# EAGLE design Longboard (EAGLE 8.0.0)

## Sheet 1 of 2
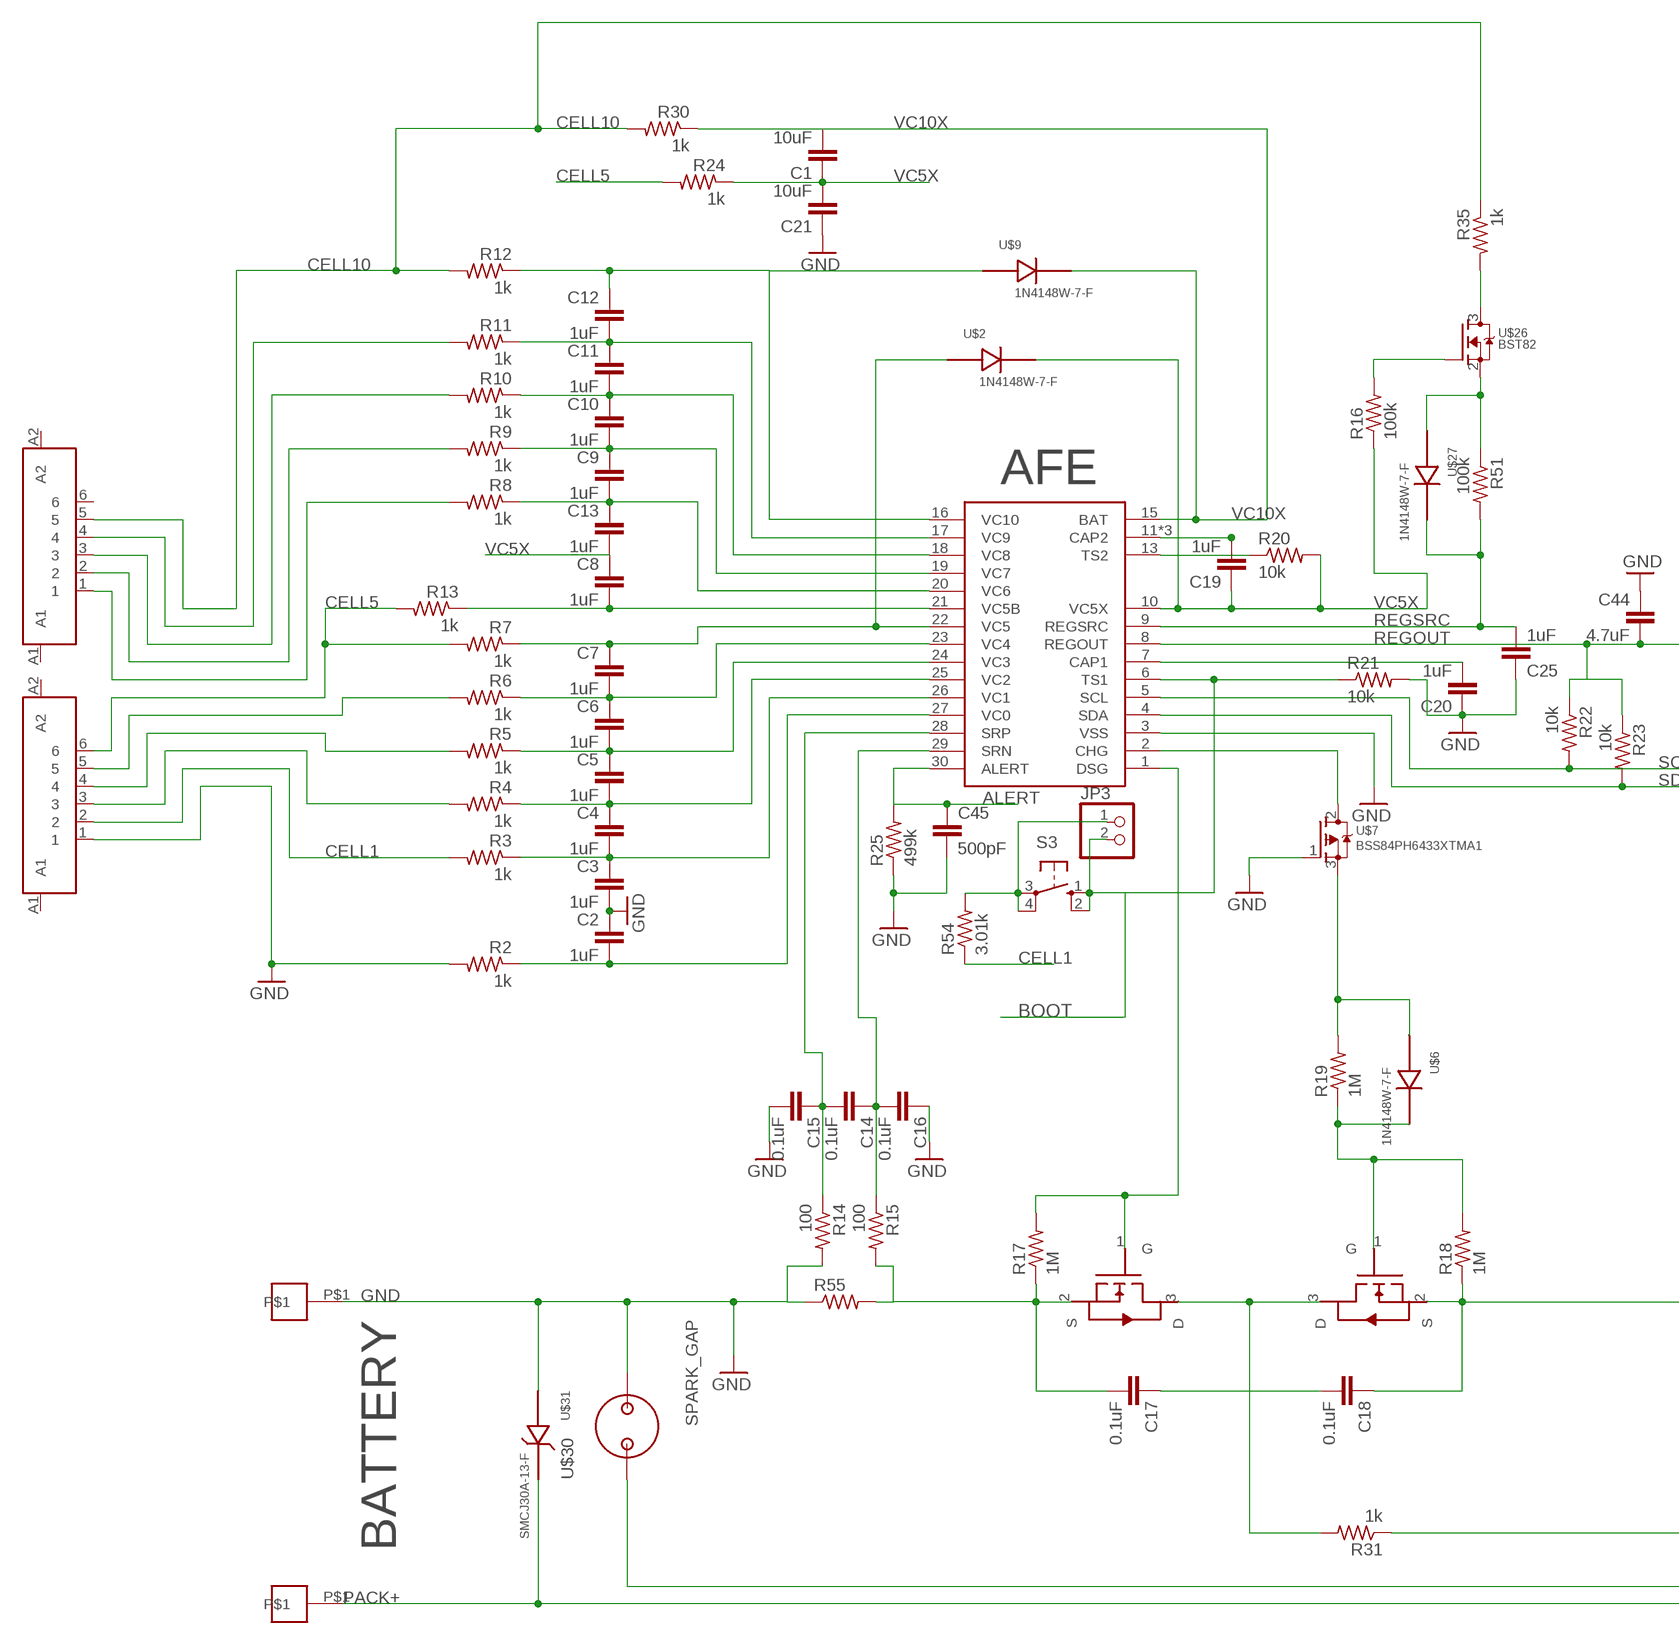
[diagram p0: schematic, sheet 1, part 1 of 2]
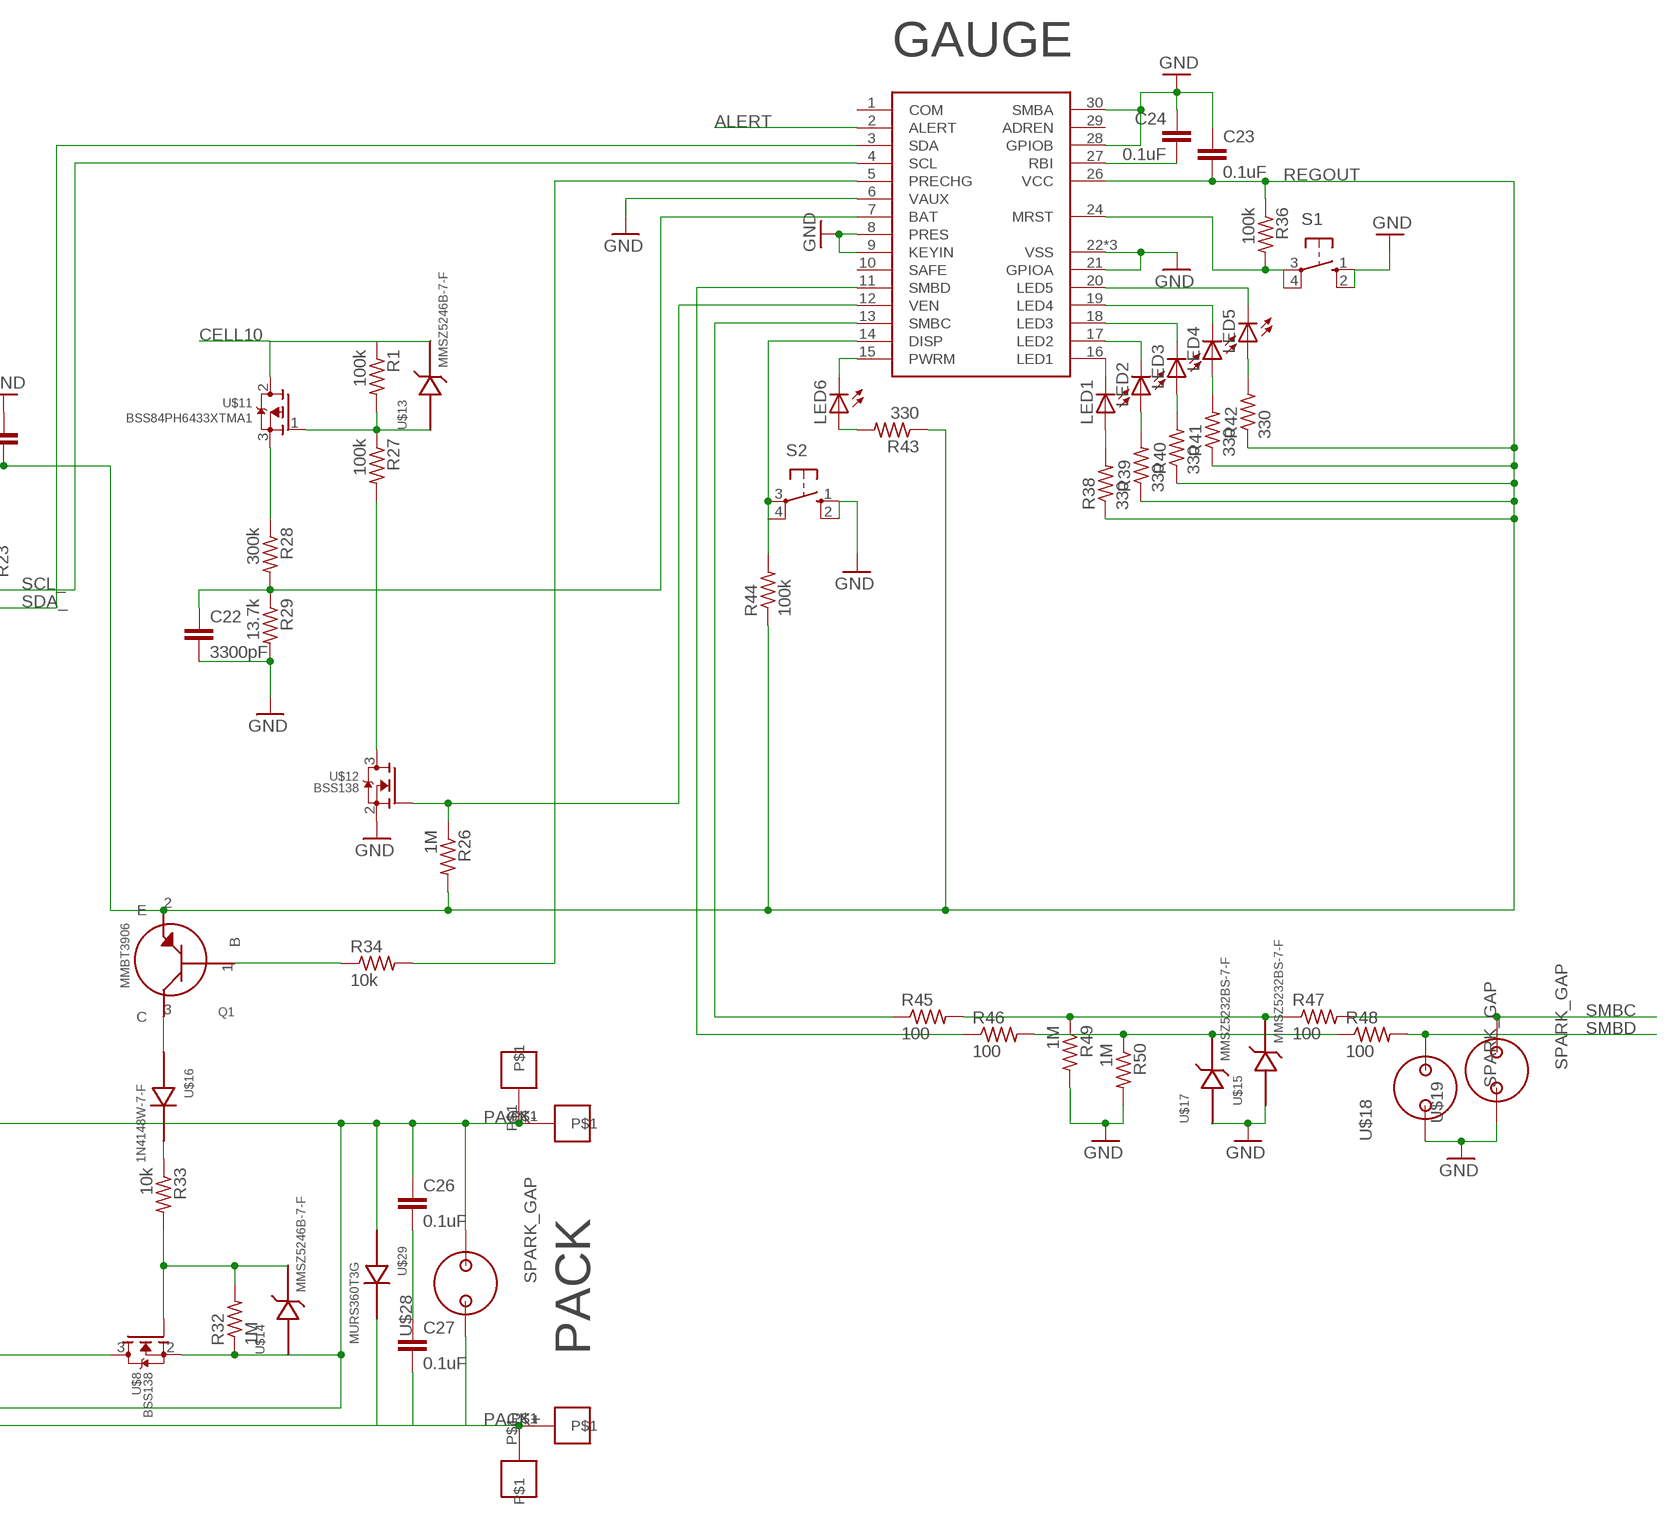
[diagram p1: schematic, sheet 1, part 2 of 2]

### Parts
C1  10uF  C-EUC1210  [C1210]
C2  1uF  C-EUC0805  [C0805]
C3  1uF  C-EUC0805  [C0805]
C4  1uF  C-EUC0805  [C0805]
C5  1uF  C-EUC0805  [C0805]
C6  1uF  C-EUC0805  [C0805]
C7  1uF  C-EUC0805  [C0805]
C8  1uF  C-EUC0805  [C0805]
C9  1uF  C-EUC0805  [C0805]
C10  1uF  C-EUC0805  [C0805]
C11  1uF  C-EUC0805  [C0805]
C12  1uF  C-EUC0805  [C0805]
C13  1uF  C-EUC0805  [C0805]
C14  0.1uF  C-EUC0805  [C0805]
C15  0.1uF  C-EUC0805  [C0805]
C16  0.1uF  C-EUC0805  [C0805]
C17  0.1uF  C-EUC0805  [C0805]
C18  0.1uF  C-EUC0805  [C0805]
C19  1uF  C-EUC0805  [C0805]
C20  1uF  C-EUC0805  [C0805]
C21  10uF  C-EUC1210  [C1210]
C22  3300pF  C-EUC0402  [C0402]
C23  0.1uF  C-EUC0805  [C0805]
C24  0.1uF  C-EUC0805  [C0805]
C25  1uF  C-EUC0805  [C0805]
C26  0.1uF  C-EUC0805  [C0805]
C27  0.1uF  C-EUC0805  [C0805]
C44  4.7uF  C-EUC0805  [C0805]
C45  500pF  C-EUC0603  [C0603]
JP3  PINHD-1X2  [1X02]
LED1  LEDCHIPLED_0603  [CHIPLED_0603]
LED2  LEDCHIPLED_0603  [CHIPLED_0603]
LED3  LEDCHIPLED_0603  [CHIPLED_0603]
LED4  LEDCHIPLED_0603  [CHIPLED_0603]
LED5  LEDCHIPLED_0603  [CHIPLED_0603]
LED6  LEDCHIPLED_0603  [CHIPLED_0603]
Q1  MMBT3906  [SOT23-3]
R1  100k  R-US_R0805  [R0805]
R2  1k  R-US_R1206  [R1206]
R3  1k  R-US_R1206  [R1206]
R4  1k  R-US_R1206  [R1206]
R5  1k  R-US_R1206  [R1206]
R6  1k  R-US_R1206  [R1206]
R7  1k  R-US_R1206  [R1206]
R8  1k  R-US_R1206  [R1206]
R9  1k  R-US_R1206  [R1206]
R10  1k  R-US_R1206  [R1206]
R11  1k  R-US_R1206  [R1206]
R12  1k  R-US_R1206  [R1206]
R13  1k  R-US_R1206  [R1206]
R14  100  R-US_R0805  [R0805]
R15  100  R-US_R0805  [R0805]
R16  100k  R-US_R0805  [R0805]
R17  1M  R-US_R1206  [R1206]
R18  1M  R-US_R1206  [R1206]
R19  1M  R-US_R1206  [R1206]
R20  10k  R-US_R0805  [R0805]
R21  10k  R-US_R0805  [R0805]
R22  10k  R-US_R0805  [R0805]
R23  10k  R-US_R0805  [R0805]
R24  1k  R-US_R1206  [R1206]
R25  499k  R-US_R0603  [R0603]
R26  1M  R-US_R1206  [R1206]
R27  100k  R-US_R0805  [R0805]
R28  300k  R-US_R0805  [R0805]
R29  13.7k  R-US_R0805  [R0805]
R30  1k  R-US_R1206  [R1206]
R31  1k  R-US_R2512  [R2512]
R32  1M  R-US_R1206  [R1206]
R33  10k  R-US_R0805  [R0805]
R34  10k  R-US_R0805  [R0805]
R35  1k  R-US_R1206  [R1206]
R36  100k  R-US_R0805  [R0805]
R38  330  R-US_R0402  [R0402]
R39  330  R-US_R0402  [R0402]
R40  330  R-US_R0402  [R0402]
R41  330  R-US_R0402  [R0402]
R42  330  R-US_R0402  [R0402]
R43  330  R-US_R0402  [R0402]
R44  100k  R-US_R0402  [R0402]
R45  100  R-US_R0805  [R0805]
R46  100  R-US_R0805  [R0805]
R47  100  R-US_R0805  [R0805]
R48  100  R-US_R0805  [R0805]
R49  1M  R-US_R1206  [R1206]
R50  1M  R-US_R1206  [R1206]
R51  100k  R-US_R0805  [R0805]
R54  3.01k  R-US_R1206  [R1206]
R55  R-US_R2512  [R2512]
S1  10-XX  [B3F-10XX]
S2  10-XX  [B3F-10XX]
S3  10-XX  [B3F-10XX]
U$1  BQ76930  [SOIC-30]
U$2  1N4148W-7-F  [SOD-123]
U$3  PAD  [PAD]
U$4  AOB290L  [TO-263]
U$5  AOB290L  [TO-263]
U$6  1N4148W-7-F  [SOD-123]
U$7  BSS84PH6433XTMA1  [SOT23-3]
U$8  BSS138  [SOT23-3]
U$9  1N4148W-7-F  [SOD-123]
U$10  BQ78350-R1  [SOIC-30]
U$11  BSS84PH6433XTMA1  [SOT23-3]
U$12  BSS138  [SOT23-3]
U$13  MMSZ5246B-7-F  [SOD-123]
U$14  MMSZ5246B-7-F  [SOD-123]
U$15  MMSZ5232BS-7-F  [SOD-323F]
U$16  1N4148W-7-F  [SOD-123]
U$17  MMSZ5232BS-7-F  [SOD-323F]
U$18  SPARK_GAP  [SPARK_GAP]
U$19  SPARK_GAP  [SPARK_GAP]
U$24  JST_6PIN  [JST_6PIN]
U$26  BST82  [SOT23-3]
U$27  1N4148W-7-F  [SOD-123]
U$28  SPARK_GAP  [SPARK_GAP]
U$29  MURS360T3G  [SMC(DO-214AB)]
U$30  SPARK_GAP  [SPARK_GAP]
U$31  SMCJ30A-13-F  [SMB(DO-214AA)]
U$33  JST_6PIN  [JST_6PIN]
U$35  PAD  [PAD]
U$36  PAD  [PAD]
U$37  PAD  [PAD]
U$38  PAD  [PAD]
U$39  PAD  [PAD]

### Nets
ALERT: C45.1 R25.2 U$1.30(ALERT) U$10.2(ALERT)
BOOT: JP3.2 R21.1 S3.1(S) S3.2(S1) U$1.6(TS1)
CELL1: R3.2 R54.1 U$33.2
CELL5: R7.2 R13.2 R24.2 U$33.6
CELL10: R1.1 R12.2 R30.2 R35.1 U$11.2(S) U$13.P$2 U$24.5
GND: C2.1 C3.2 C15.2 C16.1 C20.1 C21.1 C22.2 C23.1 C24.1 C25.1 C44.1 C45.2 R2.2 R14.2 R21.2 R25.1 R29.2 R49.2 R50.2 R55.1 S1.1(S) S1.2(S1) S2.1(S) S2.2(S1) U$1.3(VSS) U$3.P$1 U$7.1(G) U$10.6(VAUX) U$10.8(PRES) U$10.9(KEYIN) U$10.21(GPIOA) U$10.22(VSS) U$10.23(VSS) U$10.25(VSS) U$10.28(GPIOB) U$10.30(SMBA) U$12.2(S) U$15.1 U$17.1 U$18.P$1 U$19.P$1 U$30.P$2 U$31.P$1 U$33.1 ; also sheet 2
N$1: C3.1 C4.2 R3.1 U$1.26(VC1)
N$2: C4.1 C5.2 R4.1 U$1.25(VC2)
N$3: C5.1 C6.2 R5.1 U$1.24(VC3)
N$4: C6.1 C7.2 R6.1 U$1.23(VC4)
N$5: C7.1 R7.1 U$1.22(VC5) U$2.P$1
N$6: C8.2 R13.1 U$1.21(VC5B)
N$7: C9.1 C10.2 R9.1 U$1.19(VC7)
N$8: C10.1 C11.2 R10.1 U$1.18(VC8)
N$9: C11.1 C12.2 R11.1 U$1.17(VC9)
N$10: C12.1 R12.1 U$1.16(VC10) U$9.P$1
N$11: R5.2 U$33.4
N$12: C2.2 R2.1 U$1.27(VC0)
N$14: C26.2 C27.1
N$15: R4.2 U$33.3
N$16: R6.2 U$33.5
N$18: R8.2 U$24.1
N$19: R9.2 U$24.2
N$20: R10.2 U$24.3
N$21: R11.2 U$24.4
N$22: R31.1 U$8.3(D)
N$23: C9.2 C13.1 R8.1 U$1.20(VC6)
N$24: R16.2 U$26.1(G)
N$25: C20.2 U$1.7(CAP1)
N$26: C14.1 C16.2 R15.1 U$1.29(SRN)
N$27: JP3.1 R54.2 S3.3(P) S3.4(P1)
N$28: C14.2 C15.1 R14.1 U$1.28(SRP)
N$29: C17.2 R15.2 R17.1 R55.2 U$4.2(S)
N$31: R31.2 U$4.3(D) U$5.3(D)
N$32: R18.2 R19.1 U$5.1(G) U$6.P$2
N$33: R19.2 U$6.P$1 U$7.3(D)
N$34: U$1.2(CHG) U$7.2(S)
N$35: C17.1 C18.2
N$37: C19.2 U$1.11(CAP2) U$1.12(CAP2) U$1.14(CAP2)
N$38: R20.1 U$1.13(TS2)
N$40: R26.1 U$10.12(VEN) U$12.1(G)
N$41: R27.2 U$12.3(D)
N$43: R1.2 R27.1 U$11.1(G) U$13.P$1
N$44: R28.1 U$11.3(D)
N$45: C22.1 R28.2 R29.1 U$10.7(BAT)
N$46: R32.2 R33.2 U$8.1(G) U$14.P$2
N$47: Q1.3(C) U$16.P$1
N$48: R33.1 U$16.P$2
N$49: Q1.1(B) R34.1
N$50: C24.2 U$10.27(RBI)
N$51: R36.2 S1.3(P) S1.4(P1) U$10.24(MRST)
N$52: LED1.A R38.2
N$53: LED2.A R39.2
N$54: LED3.A R40.2
N$55: LED4.A R41.2
N$56: LED5.A R42.2
N$57: LED1.C U$10.16(LED1)
N$58: LED2.C U$10.17(LED2)
N$59: LED3.C U$10.18(LED3)
N$60: LED4.C U$10.19(LED4)
N$61: LED5.C U$10.20(LED5)
N$62: LED6.A R43.2
N$63: R44.2 S2.3(P) S2.4(P1) U$10.14(DISP)
N$64: LED6.C U$10.15(PWRM)
N$65: R34.2 U$10.5(PRECHG)
N$66: R46.1 U$10.11(SMBD)
N$67: R45.1 U$10.13(SMBC)
N$68: R45.2 R47.1 R49.1 U$15.2
N$69: R46.2 R48.1 R50.1 U$17.2
N$70: R51.1 U$26.2(S) U$27.P$1
N$72: R35.2 U$26.3(D)
N$73: R17.2 U$1.1(DSG) U$4.1(G)
PACK+: C27.2 U$28.P$1 U$29.2 U$31.P$2 U$35.P$1 U$36.P$1 U$39.P$1
PACK-: C18.1 C26.1 R18.1 R32.1 U$5.2(S) U$8.2(S) U$14.P$1 U$28.P$2 U$29.1 U$30.P$1 U$37.P$1 U$38.P$1
REGOUT: C23.2 C44.2 Q1.2(E) R22.1 R23.1 R26.2 R36.1 R38.1 R39.1 R40.1 R41.1 R42.1 R43.1 R44.1 U$1.8(REGOUT) U$10.26(VCC) ; also sheet 2
REGSRC: C25.2 R51.2 U$1.9(REGSRC) U$27.P$2
SCL_: R22.2 U$1.5(SCL) U$10.4(SCL)
SDA_: R23.2 U$1.4(SDA) U$10.3(SDA)
SMBC: R47.2 U$19.P$2 ; also sheet 2
SMBD: R48.2 U$18.P$2 ; also sheet 2
VC5X: C1.1 C8.1 C13.2 C19.1 C21.2 R16.1 R20.2 R24.1 U$1.10(VC5X) U$2.P$2
VC10X: C1.2 R30.1 U$1.15(BAT) U$9.P$2
Unconnected: U$10.1(COM) U$10.10(SAFE) U$10.29(ADREN) U$24.6 U$24.A1 U$24.A2 U$33.A1 U$33.A2

### Notes on the sheet
- GAUGE
- AFE
- PACK
- BATTERY

## Sheet 2 of 2
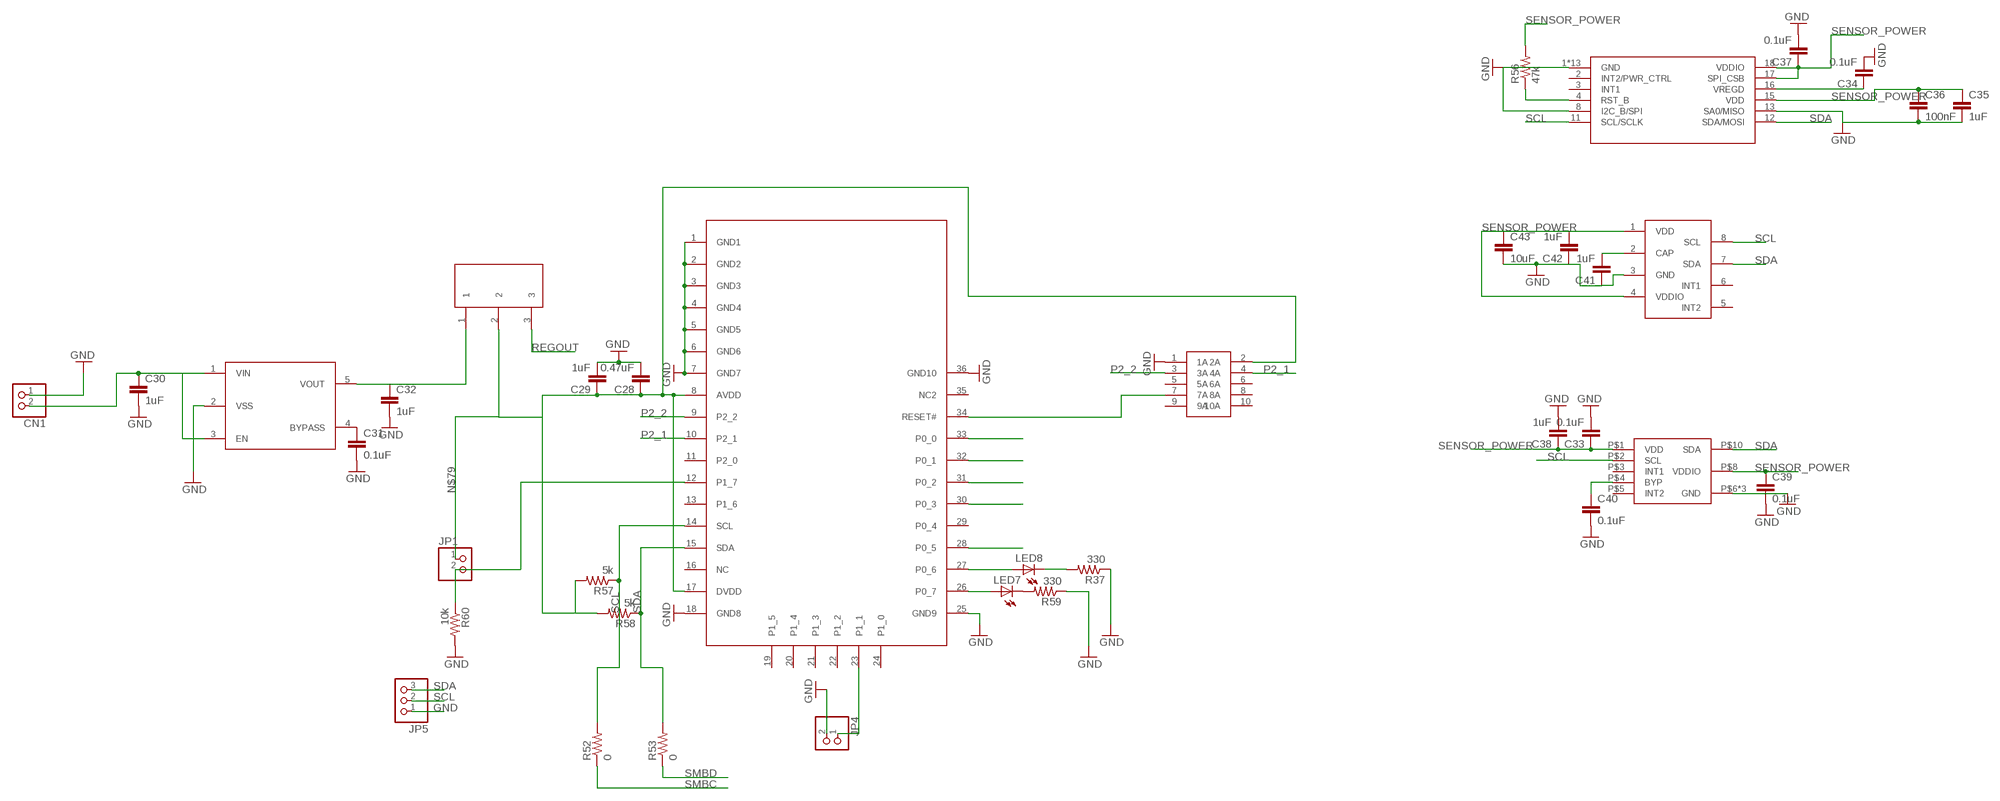
[diagram p2: schematic, sheet 2]

### Parts
C28  0.47uF  C-EUC0402  [C0402]
C29  1uF  C-EUC0402  [C0402]
C30  1uF  C-EUC0402  [C0402]
C31  0.1uF  C-EUC0402  [C0402]
C32  1uF  C-EUC0402  [C0402]
C33  0.1uF  C-EUC0402  [C0402]
C34  0.1uF  C-EUC0402  [C0402]
C35  1uF  C-EUC0402  [C0402]
C36  100nF  C-EUC0402  [C0402]
C37  0.1uF  C-EUC0402  [C0402]
C38  1uF  C-EUC0402  [C0402]
C39  0.1uF  C-EUC0402  [C0402]
C40  0.1uF  C-EUC0402  [C0402]
C41  1uF  C-EUC0402  [C0402]
C42  1uF  C-EUC0402  [C0402]
C43  10uF  C-EUC0603  [C0603]
CN1  JST_2PIN-THM  [JST-PH-2-THM]
JP1  PINHD-1X2  [1X02]
JP4  PINHD-1X2  [1X02]
JP5  PINHD-1X3  [1X03]
LED7  LEDCHIP-LED0603  [CHIP-LED0603]
LED8  LEDCHIP-LED0603  [CHIP-LED0603]
R37  330  R-US_R0402  [R0402]
R52  0  R-US_R0201  [R0201]
R53  0  R-US_R0201  [R0201]
R56  47k  R-US_R0402  [R0402]
R57  5k  R-US_R0402  [R0402]
R58  5k  R-US_R0402  [R0402]
R59  330  R-US_R0402  [R0402]
R60  10k  R-US_R0402  [R0402]
U$20  BLE113  [BLUEGIGA]
U$21  LP3985  [SOT23-5L]
U$22  RIBBON_10POS_MALE  [RIBBON_10POS_MALE]
U$23  SPDT_THRU  [SPDT_THRU]
U$25  MLP3115A2  [MLP3115A2]
U$32  MMA8653FC  [10-DFN2X2]
U$34  FXAS21002  [FXAS21002]

### Nets
CARD2: U$20.32(P0_1)
CD: U$20.33(P0_0)
CLK: U$20.28(P0_5)
GND: C28.2 C29.2 C30.2 C31.2 C32.2 C33.2 C34.2 C35.2 C36.2 C37.2 C38.2 C39.2 C40.2 C41.1 C42.1 C43.2 CN1.1 JP4.2 JP5.1 R37.1 R59.1 R60.2 U$20.1(GND1) U$20.2(GND2) U$20.3(GND3) U$20.4(GND4) U$20.5(GND5) U$20.6(GND6) U$20.7(GND7) U$20.18(GND8) U$20.25(GND9) U$20.36(GND10) U$21.2(VSS) U$22.1(1A) U$25.3(GND) U$32.P$6(GND) U$32.P$7(GND) U$32.P$9(GND) U$34.1(GND) U$34.5(GND) U$34.6(GND) U$34.7(GND) U$34.8(I2C_B/SPI) U$34.9(GND) U$34.10(GND) U$34.13(SA0/MISO) U$34.14(GND) U$34.19(GND) U$34.20(GND) U$34.21(GND) U$34.22(GND) U$34.23(GND) U$34.24(GND) ; also sheet 1
MISO: U$20.31(P0_2)
MOSI: U$20.30(P0_3)
N$13: LED8.A U$20.27(P0_6)
N$17: LED8.C R37.2
N$30: R56.1 U$34.4(RST_B)
N$36: LED7.A U$20.26(P0_7)
N$39: C30.1 CN1.2 U$21.1(VIN) U$21.3(EN)
N$42: JP4.1 U$20.23(P1_1)
N$71: JP1.2 R60.1 U$20.12(P1_7)
N$74: C31.1 U$21.4(BYPASS)
N$75: C32.1 U$21.5(VOUT) U$23.1
N$76: LED7.C R59.2
N$77: U$20.34(RESET#) U$22.7(7A)
N$78: C34.1 U$34.16(VREGD)
N$79: C28.1 C29.1 JP1.1 R57.2 R58.2 U$20.8(AVDD) U$20.17(DVDD) U$22.2(2A) U$23.2
N$81: C41.2 U$25.2(CAP)
N$84: C40.1 U$32.P$4(BYP)
P2_1: U$20.10(P2_1) U$22.4(4A)
P2_2: U$20.9(P2_2) U$22.3(3A)
REGOUT: U$23.3 ; also sheet 1
SCL: JP5.2 R52.2 R57.1 U$20.14(SCL) U$25.8(SCL) U$32.P$2(SCL) U$34.11(SCL/SCLK)
SDA: JP5.3 R53.2 R58.1 U$20.15(SDA) U$25.7(SDA) U$32.P$10(SDA) U$34.12(SDA/MOSI)
SENSOR_POWER: C33.1 C35.1 C36.1 C37.1 C38.1 C39.1 C42.2 C43.1 R56.2 U$25.1(VDD) U$25.4(VDDIO) U$32.P$1(VDD) U$32.P$8(VDDIO) U$34.15(VDD) U$34.17(SPI_CSB) U$34.18(VDDIO)
SMBC: R52.1 ; also sheet 1
SMBD: R53.1 ; also sheet 1
Unconnected: U$20.11(P2_0) U$20.13(P1_6) U$20.16(NC) U$20.19(P1_5) U$20.20(P1_4) U$20.21(P1_3) U$20.22(P1_2) U$20.24(P1_0) U$20.29(P0_4) U$20.35(NC2) U$22.5(5A) U$22.6(6A) U$22.8(8A) U$22.9(9A) U$22.10(10A) U$25.5(INT2) U$25.6(INT1) U$32.P$3(INT1) U$32.P$5(INT2) U$34.2(INT2/PWR_CTRL) U$34.3(INT1)

## Library data of the parts
C1-C45 = rcl:C-EU: CAPACITOR, European symbol
CN1 = adafruit:JST_2PIN: JST 2-Pin Connectors of various flavors SMT-RA (S2B-PH-SM4) 4UConnector #17311 SMT (B2B-PH-SM4) THM-RA (S2B-PH) THM (B2B-PH)
JP1 JP3 JP4 = pinhead:PINHD-1X2: PIN HEADER
JP5 = pinhead:PINHD-1X3: PIN HEADER
LED1-LED8 = adafruit:LED: LED OSRAM: - CHIPLED LG R971, LG N971, LY N971, LG Q971, LY Q971, LO R971, LY R971 LH N974, LH R974 LS Q976, LO Q976, LY Q976 LO Q996 - Hyper CHIPLED LW Q18S LB Q993, LB Q99A, LB R99A - SideLED LS A670, LO A670, LY A670, LG A670, LP A670 LB A673, LV A673, LT A673, LW A673 LH A674 LY A675 LS A676, LA A676, LO A676, LY A676, LW A676 LS A679, LY A679, LG A679 - Hyper Micro SIDELED® LS Y876, LA Y876, LO Y876, LY Y876 LT Y87S - SmartLED LW L88C, LW L88S LB L89C, LB L89S, LG L890 LS L89K, LO L89K, LY L89K LS L896, LA L896, LO L896, LY L896 - TOPLED LS T670, LO T670, LY T670, LG T670, LP T670 LSG T670, LSP T670, LSY T670, LOP T670, LYG T670 LG T671, LOG T671, LSG T671 LB T673, LV T673, LT T673, LW T673 LH T674 LS T676, LA T676, LO T676, LY T676, LB T676, LH T676, LSB T676, LW T676 LB T67C, LV T67C, LT T67C, LS T67K, LO T67K, LY T67K, LW E67C LS E67B, LA E67B, LO E67B, LY E67B, LB E67C, LV E67C, LT E67C LW T67C LS T679, LY T679, LG T679 LS T770, LO T770, LY T770, LG T770, LP T770 LB T773, LV T773, LT T773, LW T773 LH T774 LS E675, LA E675, LY E675, LS T675 LS T776, LA T776, LO T776, LY T776, LB T776 LHGB T686 LT T68C, LB T68C - Hyper Mini TOPLED® LB M676 - Mini TOPLED Santana® LG M470 LS M47K, LO M47K, LY M47K Source: http://www.osram.convergy.de/
Q1 = Charles:MMBT3906: TRANSISTOR PNP 40V 0.2A
R1-R60 = rcl:R-US_: RESISTOR, American symbol
S1-S3 = switch-omron:10-XX: OMRON SWITCH; MPN: B3F-1000; OC_FARNELL: 176432; OC_NEWARK: 36M3542
U$1 = Charles:BQ76930
U$2 U$6 U$9 U$16 U$27 = Charles:1N4148W-7-F: DIODE GENERAL PURPOSE 100V 300MA
U$3 U$35-U$39 = Charles:PAD
U$4 U$5 = Charles:AOB290L
U$7 U$11 = Charles:BSS84PH6433XTMA1: MOSFET P-Channel 60V 170MA SOT-23
U$8 U$12 = Charles:BSS138: MOSFET N-CH 50V 220MA
U$10 = Charles:BQ78350-R1
U$13 U$14 = Charles:MMSZ5246B-7-F: ZENER DIODE 16V 500MW
U$15 U$17 = Charles:MMSZ5232BS-7-F: ZENER DIODE 5.6V 200MW
U$18 U$19 U$28 U$30 = Charles:SPARK_GAP: Spark Gap 0.2mm ~2kV for ESD Protection
U$20 = James_Updated:BLE113
U$21 = James_Updated:LP3985
U$22 = James_Updated:RIBBON_10POS_MALE
U$23 = James_Updated:SPDT_THRU
U$24 U$33 = James_Updated:JST_6PIN
U$25 = Charles:MLP3115A2: I2C Precision Altimeter
U$26 = Charles:BST82: MOSFET N-CH 50V 220MA
U$29 = Charles:MURS360T3G: Ultrafast Power Rectifier, Diode General Purpose 600V 3A
U$31 = Charles:SMCJ30A-13-F: Zener Diode - 600 Watt Transient Voltage Suppressor - 30VWM 48.4VC - Diode Inc.
U$32 = Charles:MMA8653FC: 3-Axis, 10-bit Digital Accelerometer
U$34 = Charles:FXAS21002: 3-Axis Digital Angular Rate Gyroscope (I2C/SPI)

## Board
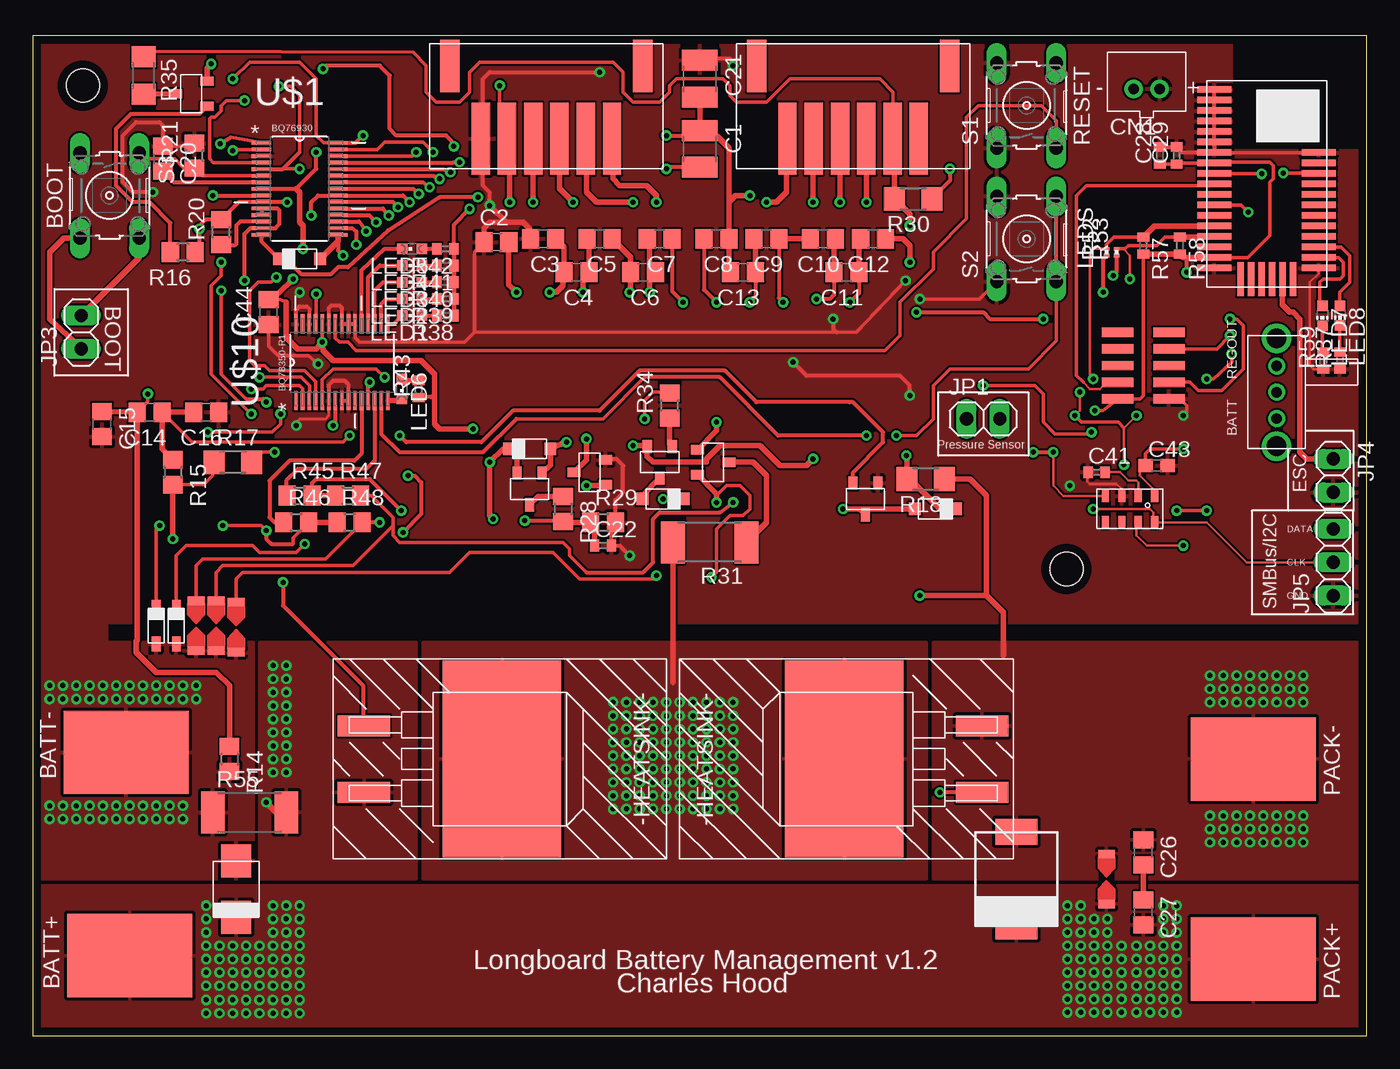
[diagram p3: board, top side]
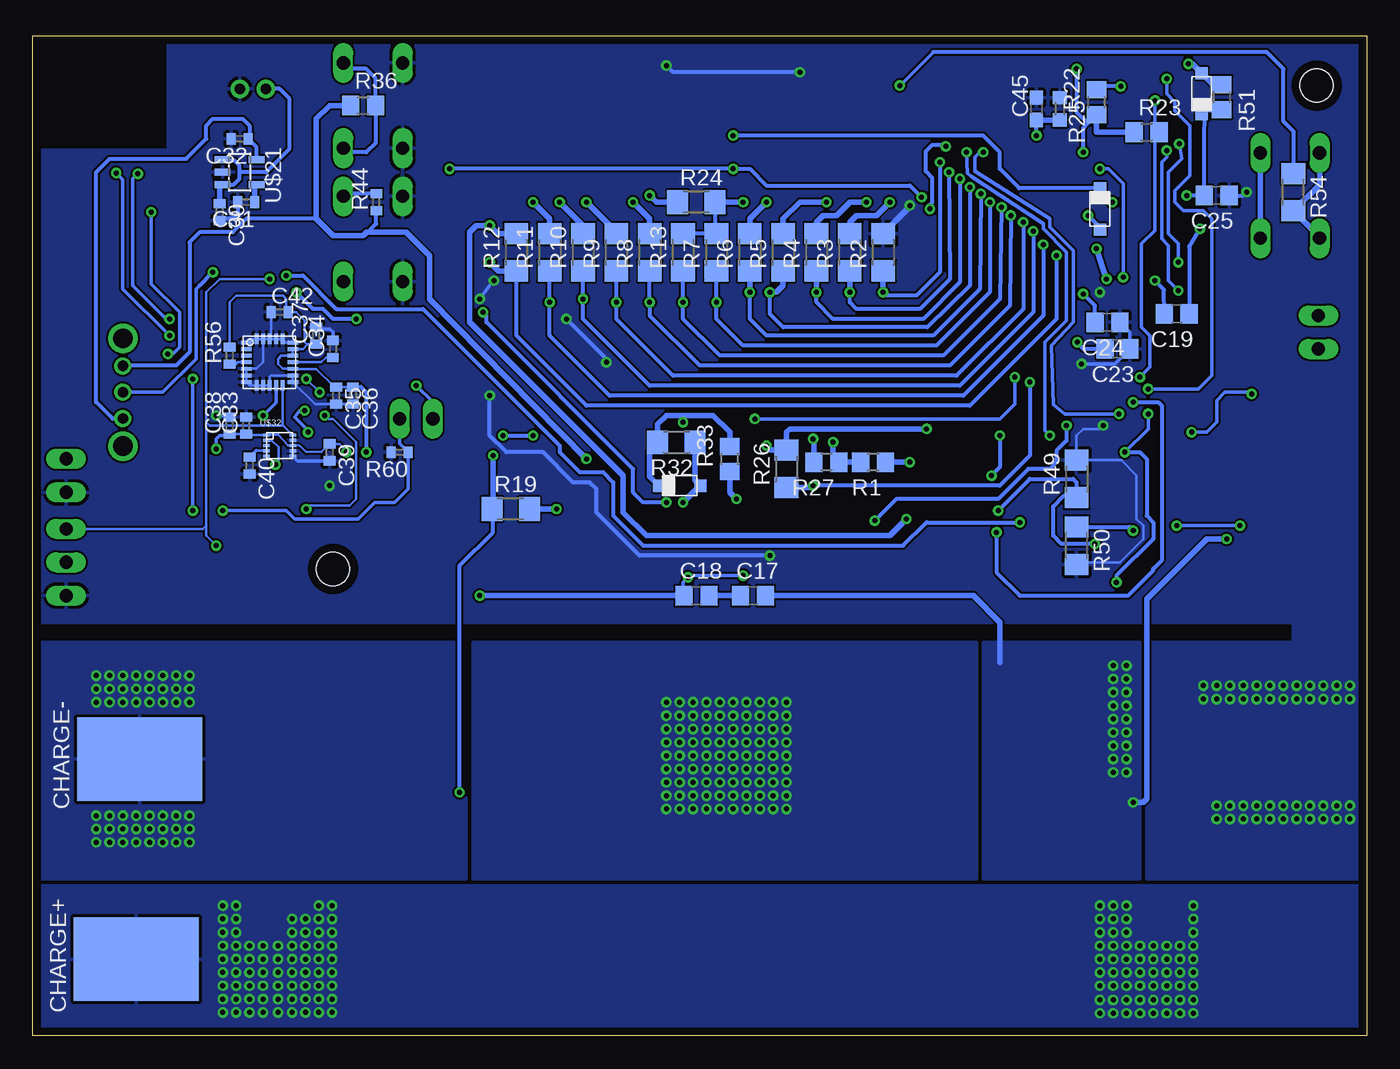
[diagram p4: board, bottom side, seen from below]

Size 101.6 x 76.2 mm. Coordinates in mm from the lower left corner, seen from the top.
Outline: 101.6,0 101.6,76.2 0,76.2 0,0 101.6,0
Copper layers (1*16): Top 0.035mm / dielectric 1.5mm / Bottom 0.035mm
Design rules "DRC_rules": minimum track width 8mil, minimum drill 15mil, track to track 6mil, track to pad 6mil, pad to pad 6mil, via to via 6mil, smd to smd 6mil, copper to edge 25mil, drill to drill 6mil, minimum pad ring 10mil, minimum via ring 8mil, stop-mask expansion 4mil, vias tented up to drill 0mil, thermal gap 10mil
Holes 2.54 mm at 3.81,72.39 78.74,35.56
tRestrict: area 91.4,67.6 to 103.6,76.2
bRestrict: area 91.4,67.6 to 103.6,76.2

### Footprints (pad centres in the part's own frame; a part is rotated, then mirrored left to right if it is on the bottom)
C1210 = smd 1.6 x 2.7: 1 -1.4,0; 2 1.4,0
C0805 = smd 1.3 x 1.5: 1 -0.95,0; 2 0.95,0
C0402 = smd 0.7 x 0.9: 1 -0.65,0; 2 0.65,0
C0603 = smd 1.1 x 1: 1 -0.85,0; 2 0.85,0
JST-PH-2-THM = drill 0.8 pad 1.422: 1 1,0; 2 -1,0
1X02 = drill 1.016 long: 1 -1.27,0; 2 1.27,0
1X03 = drill 1.016 long: 1 -2.54,0; 2 0,0; 3 2.54,0
CHIPLED_0603 = smd 0.8 x 0.8: A 0,-0.75; C 0,0.75
CHIP-LED0603 = smd 0.8 x 0.8: A 0,-0.75; C 0,0.75
SOT23-3 = smd 0.7 x 1: 1 -0.95,-1.2; 2 0.95,-1.2; 3 0,1.2
R0805 = smd 1.3 x 1.5: 1 -0.95,0; 2 0.95,0
R1206 = smd 1.6 x 1.803: 1 -1.422,0; 2 1.422,0
R0603 = smd 1 x 1.1: 1 -0.85,0; 2 0.85,0
R2512 = smd 1.8 x 3.2: 1 -2.8,0; 2 2.8,0
R0402 = smd 0.7 x 0.9: 1 -0.65,0; 2 0.65,0
R0201 = smd 0.28 x 0.43: 1 -0.255,0; 2 0.255,0
B3F-10XX = drill 1.016 long: 1 -3.251,2.261; 2 3.251,2.261; 3 -3.251,-2.261; 4 3.251,-2.261
SOIC-30 = smd 1.473 x 0.279: 1 -2.921,3.505; 2 -2.921,2.997; 3 -2.921,2.489; 4 -2.921,2.007; 5 -2.921,1.499; 6 -2.921,0.991; 7 -2.921,0.508; 8 -2.921,0; 9 -2.921,-0.508; 10 -2.921,-0.991; 11 -2.921,-1.499; 12 -2.921,-2.007; 13 -2.921,-2.489; 14 -2.921,-2.997; 15 -2.921,-3.505; 16 2.921,-3.505; 17 2.921,-2.997; 18 2.921,-2.489; 19 2.921,-2.007; 20 2.921,-1.499; 21 2.921,-0.991; 22 2.921,-0.508; 23 2.921,0; 24 2.921,0.508; 25 2.921,0.991; 26 2.921,1.499; 27 2.921,2.007; 28 2.921,2.489; 29 2.921,2.997; 30 2.921,3.505
SOD-123 = smd 0.9 x 0.95: P$1 -1.575,0; P$2 1.575,0
PAD = smd 9.525 x 6.35: P$1 0,0
TO-263 = smd 1.6 x 4: 1 -2.54,-5.25; 2 2.54,-5.25 | smd 15 x 9: 3 0,5.25
SOD-323F = smd 0.65 x 1.15: 1 0,1.4; 2 0,-1.4
SPARK_GAP = smd 1.27 x 0.635: P$1 0,1.905; P$2 0,-1.905
BLUEGIGA = smd 2.6 x 0.5: 1 -3.975,9.6; 2 -3.975,8.8; 3 -3.975,8; 4 -3.975,7.2; 5 -3.975,6.4; 6 -3.975,5.6; 7 -3.975,4.8; 8 -3.975,4; 9 -3.975,3.2; 10 -3.975,2.4; 11 -3.975,1.6; 12 -3.975,0.8; 13 -3.975,0; 14 -3.975,-0.8; 15 -3.975,-1.6; 16 -3.975,-2.4; 17 -3.975,-3.2; 18 -3.975,-4; 25 3.975,-4; 26 3.975,-3.2; 27 3.975,-2.4; 28 3.975,-1.6; 29 3.975,-0.8; 30 3.975,0; 31 3.975,0.8; 32 3.975,1.6; 33 3.975,2.4; 34 3.975,3.2; 35 3.975,4; 36 3.975,4.8 | smd 0.5 x 2.6: 19 -2,-4.85; 20 -1.2,-4.85; 21 -0.4,-4.85; 22 0.4,-4.85; 23 1.2,-4.85; 24 2,-4.85
SOT23-5L = smd 0.55 x 1.2: 1 -0.95,-1.3; 2 0,-1.3; 3 0.95,-1.3; 4 0.95,1.3; 5 -0.95,1.3
RIBBON_10POS_MALE = smd 0.72 x 2.4: 1 -5.08,-1.95; 2 -5.08,1.95; 3 -3.81,-1.95; 4 -3.81,1.95; 5 -2.54,-1.95; 6 -2.54,1.95; 7 -1.27,-1.95; 8 -1.27,1.95; 9 0,-1.95; 10 0,1.95
SPDT_THRU = drill 0.787: 1 -2.007,0; 2 0,0; 3 2.007,0 | drill 1.499: A1 -4.102,0; A2 4.102,0
JST_6PIN = smd 1.4 x 5.5: 1 -5,-2.775; 2 -3,-2.775; 3 -1,-2.775; 4 1,-2.775; 5 3,-2.775; 6 5,-2.775 | smd 1.5 x 4: A1 -7.35,2.775; A2 7.35,2.775
MLP3115A2 = smd 0.95 x 0.55: 1 -1,1.875; 2 -1,0.625; 3 -1,-0.625; 4 -1,-1.875; 5 1,-1.875; 6 1,-0.625; 7 1,0.625; 8 1,1.875
SMC(DO-214AB) = smd 1.96 x 3.2: 1 -3.6,0; 2 3.6,0
SMB(DO-214AA) = smd 2.5 x 2.3: P$1 -2.15,0; P$2 2.15,0
10-DFN2X2 = smd 0.5 x 0.24: P$1 -1,0.8; P$2 -1,0.4; P$3 -1,0; P$4 -1,-0.4; P$5 -1,-0.8; P$6 1,-0.8; P$7 1,-0.4; P$8 1,0; P$9 1,0.4; P$10 1,0.8
FXAS21002 = smd 0.8 x 0.3: 1 -1.775,1.5; 2 -1.775,1; 3 -1.775,0.5; 4 -1.775,0; 5 -1.775,-0.5; 6 -1.775,-1; 7 -1.775,-1.5; 13 1.775,-1.5; 14 1.775,-1; 15 1.775,-0.5; 16 1.775,0; 17 1.775,0.5; 18 1.775,1; 19 1.775,1.5 | smd 0.3 x 0.8: 8 -1,-1.775; 9 -0.5,-1.775; 10 0,-1.775; 11 0.5,-1.775; 12 1,-1.775; 20 1,1.775; 21 0.5,1.775; 22 0,1.775; 23 -0.5,1.775; 24 -1,1.775

### Placement (x,y rotation side)
C1  50.8,67.56 270 top
C2  35.31,60.45 0 top
C3  38.86,60.71 180 top
C4  41.4,58.17 180 top
C5  43.18,60.71 180 top
C6  46.48,58.17 180 top
C7  47.75,60.71 180 top
C8  52.07,60.71 180 top
C9  55.88,60.71 180 top
C10  60.2,60.71 180 top
C11  61.98,58.17 180 top
C12  64.01,60.71 180 top
C13  54.1,58.17 180 top
C14  8.89,47.5 180 top
C15  5.27,46.61 270 top
C16  13.21,47.5 180 top
C17  46.74,33.53 0 bottom
C18  51.05,33.53 0 bottom
C19  14.48,54.99 180 bottom
C20  9.91,66.8 270 top
C21  50.8,72.9 270 top
C22  43.43,37.34 0 top
C23  18.97,52.32 180 bottom
C24  19.74,54.36 180 bottom
C25  11.43,64.01 180 bottom
C26  84.58,13.97 270 top
C27  84.58,9.4 270 top
C28  85.85,67.06 90 top
C29  87.12,67.06 90 top
C30  87.38,62.74 270 bottom
C31  85.34,63.5 180 bottom
C32  85.85,68.33 180 bottom
C33  85.34,46.48 90 bottom
C34  78.74,52.32 90 bottom
C35  78.49,48.77 270 bottom
C36  77.22,48.77 270 bottom
C37  80.01,53.34 90 bottom
C38  86.61,46.48 90 bottom
C39  78.99,44.45 270 bottom
C40  85.09,43.43 270 bottom
C41  81.03,42.93 0 top
C42  82.8,55.12 0 bottom
C43  85.6,43.43 0 top
C44  17.96,55.12 90 top
C45  25.15,70.61 90 bottom
CN1  84.84,72.14 0 top
JP1  72.39,46.99 0 top
JP3  3.68,53.59 90 top
JP4  99.06,42.67 270 top
JP5  99.06,36.07 90 top
LED1  28.88,54.86 90 top
LED2  28.88,56.13 90 top
LED3  28.88,57.4 90 top
LED4  28.88,58.67 90 top
LED5  28.88,59.94 90 top
LED6  28.12,49.28 180 top
LED7  98.22,54.84 180 top
LED8  99.57,54.86 180 top
Q1  47.75,43.69 180 top
R1  37.59,43.69 180 bottom
R2  36.83,59.69 90 bottom
R3  39.37,59.69 90 bottom
R4  41.91,59.69 90 bottom
R5  44.45,59.69 90 bottom
R6  46.99,59.69 90 bottom
R7  49.53,59.69 90 bottom
R8  54.61,59.69 90 bottom
R9  57.15,59.69 90 bottom
R10  59.69,59.69 90 bottom
R11  62.23,59.69 90 bottom
R12  64.77,59.69 90 bottom
R13  52.07,59.69 90 bottom
R14  14.99,21.08 270 top
R15  10.67,42.93 270 top
R16  11.43,59.69 180 top
R17  15.24,43.69 0 top
R18  68,42.42 180 top
R19  65.2,40.13 0 bottom
R20  14.35,61.21 90 top
R21  12.32,67.06 90 top
R22  20.57,71.12 90 bottom
R23  16.76,68.83 0 bottom
R24  51.05,63.5 0 bottom
R25  23.37,70.61 270 bottom
R26  44.2,43.18 90 bottom
R27  41.15,43.69 180 bottom
R28  40.39,40.13 270 top
R29  43.43,39.12 0 top
R30  67.06,63.75 180 top
R31  51.56,37.59 180 top
R32  52.58,45.21 180 bottom
R33  48.51,43.94 90 bottom
R34  48.51,48.01 90 top
R35  8.45,73.15 270 top
R36  76.45,70.87 0 bottom
R37  99.57,51.44 90 top
R38  31.42,54.86 180 top
R39  31.42,56.13 180 top
R40  31.42,57.4 180 top
R41  31.42,58.67 180 top
R42  31.42,59.94 180 top
R43  29.39,49.28 90 top
R44  75.44,63.5 90 bottom
R45  20.32,41.15 0 top
R46  20.07,39.12 0 top
R47  24,41.15 0 top
R48  24.13,39.12 0 top
R49  22.1,42.42 90 bottom
R50  22.1,37.34 270 bottom
R51  11.05,71.5 270 bottom
R52  81.79,59.69 90 top
R53  82.55,59.69 90 top
R54  5.59,64.26 270 bottom
R55  16.51,17.02 0 top
R56  86.61,51.82 90 bottom
R57  84.58,60.2 270 top
R58  87.38,60.2 270 top
R59  98.3,51.44 90 top
R60  73.66,44.45 180 bottom
S1  75.69,70.87 90 top
S2  75.69,60.71 90 top
S3  5.84,64.01 270 top
U$1  20.32,64.52 0 top
U$2  20.32,62.99 90 bottom
U$3  7.11,21.59 0 top
U$4  30.48,21.08 270 top
U$5  67.06,21.08 90 top
U$6  68.76,40.13 0 top
U$7  63.42,40.89 180 top
U$8  51.82,43.69 270 top
U$9  20.32,59.18 180 top
U$10  23.55,51.31 90 top
U$11  37.85,41.66 180 top
U$12  42.42,42.93 90 top
U$13  37.85,44.7 180 top
U$14  52.32,41.91 180 bottom
U$15  10.92,31.24 180 top
U$16  48.01,40.89 0 top
U$17  9.4,31.24 180 top
U$18  12.45,31.24 180 top
U$19  13.97,31.24 180 top
U$20  93.98,62.48 0 top
U$21  85.85,65.79 270 bottom
U$22  84.58,53.59 90 top
U$23  94.74,49.02 90 top
U$24  62.48,71.12 0 top
U$25  83.57,40.13 270 top
U$26  12.06,71.76 90 top
U$27  12.57,71.76 270 bottom
U$28  81.79,11.94 180 top
U$29  74.93,11.94 270 top
U$30  15.49,31.11 0 top
U$31  15.49,11.18 270 top
U$32  82.8,44.96 0 bottom
U$33  39.12,71.12 0 top
U$34  83.57,51.31 0 bottom
U$35  7.37,6.1 0 top
U$36  92.96,5.84 180 top
U$37  92.96,21.08 0 top
U$38  93.47,21.08 0 bottom
U$39  93.73,5.84 0 bottom

### Tracks (layer width: path | path; a pad name or v marks a point on that pad's centre or on a via)
ALERT  (via drill 0.38)
  Top 0.254: U$10.2 20.55,49.3 20.32,49.53 17.78,49.53 17.53,49.28 v16.64,49.28 | U$1.30 22.15,68.02 21.59,68.58 21.59,72.9 20.32,74.17 16.51,74.17 v15.24,72.9
  Top 0.305: U$1.30 24.59,68.02 v25.15,68.58
  Bottom 0.254: v15.24,72.9 15.24,71.76 14.61,71.12 14.61,70.48 13.46,69.34 13.46,65.53 14.61,64.39 14.61,63.5 13.97,62.87 12.45,62.87 11.81,62.23 11.81,50.29 12.83,49.28 v16.64,49.28
  Bottom 0.305: v25.15,68.58 C45.1
  Bottom 0.406: R25.2 C45.1
BOOT
  Top 0.254: U$1.6 12.92,65.51 R21.1 11.49,66.11 10.79,66.8 8.56,66.8 S3.1
  Top 0.406: JP3.2 8.1,59.28 S3.2
  Bottom 0.406: S3.2 S3.1
CELL1  (via drill 0.38)
  Top 0.254: v35.56,72.39 35.56,68.9 U$33.2
  Top 0.406: v36.32,63.5 36.32,68.14 U$33.2
  Bottom 0.254: 33.02,74.93 v35.56,72.39
  Bottom 0.305: R54.1 5.59,68.9 6.35,69.66 6.35,73.66 7.62,74.93 33.02,74.93
  Bottom 0.406: R3.2 39.37,61.98 38.86,62.48 37.34,62.48 v36.32,63.5
CELL5  (via drill 0.38)
  Top 0.406: v47.5,63.5 47.5,64.01 46.74,64.77 44.7,64.77 44.2,65.28 44.2,68.27 U$33.6
  Bottom 0.305: R24.2 49.63,61.21 R7.2 R13.2
  Bottom 0.406: R24.2 v47.5,63.5
CELL10  (via drill 0.38)
  Top 0.254: 8.89,74.99 28.96,74.93 29.97,73.91 29.97,71.88 30.73,71.12 32.51,71.12 33.27,71.88 33.27,73.41 34.04,74.17 44.2,74.17 44.96,73.41 44.96,71.88 45.72,71.12 47.75,71.12 48.51,71.88 48.51,72.39 49.02,72.9 52.58,72.9 53.09,72.39 53.09,71.63 53.59,71.12 55.88,71.12 57.66,72.9 64.52,72.9 65.53,71.88 65.53,68.39 U$24.5
  Top 0.406: U$11.2 36.9,44.08 U$13.P$2 35.81,44.7 v34.8,43.69 34.8,39.62 v35.05,39.37 | U$24.5 65.63,68.35 R30.2 66.8,62.59 v66.8,61.72 | R35.1 8.36,74.46 8.89,74.99
  Bottom 0.406: R1.1 v34.8,43.69 | R12.2 66.19,61.11 v66.8,61.72 67.82,61.72 68.33,61.21 68.33,54.36 56.64,42.67 56.64,39.88 54.86,38.1 36.32,38.1 v35.05,39.37
GND  (via drill 0.38)
  Top 0.203: U$25.3 82.94,41.65 82.55,42.04 80.52,42.04 80.33,42.23 80.33,42.88 C41.1 | U$20.25 97.95,58.08 97.28,57.4 97.28,51.05 97.54,50.8 98.28,50.8 R59.1 | U$10.6 22.54,48.37 22.54,47.24 22.29,46.99 20.32,46.99 20.07,46.74 v20.07,46.48
  Top 0.254: C44.1 17.96,52.53 18.67,51.82 20.95,51.82 v21.72,51.18 | U$10.21 24.54,53.19 24.89,52.83 32.89,52.83 33.66,53.59 | 33.66,53.59 33.66,59.75 C2.1 | U$20.7 U$20.36 | 22.54,55.44 22.54,54.24 U$10.25 | 20.89,55.56 21.08,55.37 21.08,54.25 U$10.28 | C20.1 12.06,67.75 R21.2 | U$22.1 87.38,48.51 87.88,48.01 87.88,47.5 v87.63,47.24 | 33.66,53.59 61.21,53.59 62.74,53.59 v66.48,57.53 | v67.56,56.13 72.11,56.13 S2.1
  Top 0.305: U$10.21 U$10.22 U$10.23 23.55,55.45 23.37,55.63 22.73,55.63 22.54,55.44 | C28.2 C29.2 87.54,67.28 U$20.7 U$20.6 U$20.5 U$20.4 U$20.3 U$20.2 U$20.1 | C22.2 44.08,38.82 R29.2 44.38,40.83 44.96,41.4 44.96,43.43 44.45,43.94 43.68,43.94 U$12.2 | v34.8,63.25 34.8,64.26 34.29,64.77 34.29,68.17 | 34.29,68.17 U$33.1 | U$10.6 22.55,49.61 22.86,49.91 23.75,49.91 24,49.66 24,48.44 U$10.9 U$10.8 | U$10.30 20.04,55.28 20.32,55.56 20.89,55.56 | v9.14,64.26 7.62,64.26 6.86,65.02 6.86,68.58 7.87,69.6 9.65,69.6 9.91,69.34 C20.1 | 34.29,68.17 34.29,72.9 34.8,73.41 v43.18,73.41 | v53.34,73.91 53.34,74.17 53.09,74.42 50.92,74.42 C21.1 | 61.21,53.59 60.96,53.85 v60.96,54.61 | 43.94,37.34 44.7,37.34 v45.47,36.58 | v57.91,51.31 58.93,50.29 66.04,50.29 66.8,49.53 v66.8,48.77
  Top 0.406: C2.1 34.36,61.53 34.8,61.98 36.07,61.98 | C3.2 37.85,60.77 37.85,61.47 37.34,61.98 36.07,61.98 | 36.07,61.98 v34.8,63.25
  Bottom 0.203: U$34.19 82.29,52.81 U$34.20 U$34.21 U$34.22 | C42.1 83.45,53.2 U$34.22 | U$34.1 85.07,53.08 U$34.24 U$34.23 | U$34.22 U$34.23 | U$34.5 U$34.6 | U$34.5 U$34.7 85.07,49.53 U$34.8 U$34.9 U$34.10 83.57,50.16 83.44,50.29 81.81,50.29 | 81.81,50.29 U$34.14 | 81.81,50.29 81.81,49.82 U$34.13 | C36.2 C35.2 80.1,48.12 U$34.13 | 81.51,49.53 U$34.13 | U$34.5 84.57,50.81 84.07,51.31 U$34.23 | R50.2 21.95,36.07 18.8,36.07 17.02,37.85 17.02,38.86 17.53,39.37 17.53,42.67 18.69,43.84 R49.2 22.1,45.72 21.59,46.23 20.32,46.23 v20.07,46.48
  Bottom 0.254: C24.1 18.02,53.59 C23.1 19.17,51.18 v21.72,51.18 | C39.2 81.45,43.8 U$32.P$6 U$32.P$7 | C34.2 78.74,53.59 78.99,53.85 79.87,53.85 C37.2 | v87.63,47.24 86.73,47.24 C38.2 | v66.48,57.53 66.8,57.15 v67.56,56.13
  Bottom 0.305: C31.2 85.99,62.6 86.36,62.23 87.23,62.23 C30.2 | C25.1 9.4,64.01 v9.14,64.26 | v43.18,73.41 52.83,73.41 v53.34,73.91 | v45.47,36.58 55.37,36.58 58.67,39.88 58.67,41.66 59.18,42.16 60.45,42.16 62.74,44.45 65.53,44.45 66.8,45.72 v66.8,48.77 | v57.91,51.31 57.91,51.56 v60.96,54.61
  Bottom 0.406: v34.8,63.25 34.8,63.14 R2.2
  other vias: 1.27,17.53 2.29,17.53 3.3,17.53 4.32,17.53 5.33,17.53 6.35,17.53 7.37,17.53 8.38,17.53 1.27,25.65 2.29,25.65 3.3,25.65 4.32,25.65 5.33,25.65 6.35,25.65 7.37,25.65 8.38,25.65 9.4,17.53 10.41,17.53 11.43,17.53 9.4,16.51 10.41,16.51 11.43,16.51 1.27,16.51 2.29,16.51 3.3,16.51 4.32,16.51 5.33,16.51 6.35,16.51 7.37,16.51 8.38,16.51 9.4,26.67 10.41,26.67 11.43,26.67 12.45,26.67 9.4,25.65 10.41,25.65 11.43,25.65 12.45,25.65 1.27,26.67 2.29,26.67 3.3,26.67 4.32,26.67 5.33,26.67 6.35,26.67 7.37,26.67 8.38,26.67 20.32,56.64 78.99,41.91
  pour Top: 0,76.2 101.6,76.2 101.6,31.5 5.59,31.5 5.59,29.97 16.76,29.97 16.76,11.94 0,11.94
  pour Bottom: 0,31.5 101.6,31.5 101.6,75.95 0,75.95
  pour Bottom: 0,31.5 5.59,31.5 5.59,29.97 16.76,29.97 16.76,11.94 0,11.94
N$1  (via drill 0.38)
  Top 0.305: U$1.26 31.27,66.02 v31.81,65.79
  Top 0.406: C3.1 40.45,60.07 C4.2 40.39,58.1 40.39,57.15 39.88,56.64 v39.37,56.64
  Bottom 0.305: v31.81,65.79 31.75,57.66 34.04,55.37 38.86,55.37 39.37,55.88 v39.37,56.64
  Bottom 0.406: R3.1 v39.37,56.64
N$2  (via drill 0.38)
  Top 0.305: U$1.25 30.5,65.51 v30.99,65.28
  Top 0.406: C5.2 42.35,60.58 C4.1 41.91,57.72 v41.91,56.64
  Bottom 0.305: v30.99,65.28 30.99,57.4 33.78,54.61 40.64,54.61 41.91,55.88 v41.91,56.64
  Bottom 0.406: R4.1 v41.91,56.64
N$3  (via drill 0.38)
  Top 0.305: U$1.24 29.72,65.02 v30.23,64.64
  Top 0.406: C5.1 45.53,59.3 C6.2 45.53,56.71 v45.47,56.64
  Bottom 0.305: v30.23,64.64 30.23,57.15 33.47,53.98 44.45,53.98 45.47,54.99 v45.47,56.64
  Bottom 0.406: v45.47,56.64 44.96,56.64 44.45,57.15 R5.1
N$4  (via drill 0.38)
  Top 0.305: U$1.23 28.96,64.52 v29.4,64.14
  Top 0.406: C6.1 47.24,58.17 46.99,58.42 | 46.99,58.42 46.99,60.52 C7.2 | v46.99,56.64 46.99,58.42
  Bottom 0.305: v29.4,64.14 29.46,56.9 33.02,53.34 45.72,53.34 46.99,54.61 v46.99,56.64
  Bottom 0.406: R6.1 v46.99,56.64
N$5  (via drill 0.38)
  Top 0.305: v28.7,63.5 28.19,64.01 U$1.22 21.72,64.01 21.21,63.5 v21.21,62.48 | C7.1 48.7,56.71 v49.53,55.88
  Bottom 0.305: v28.7,63.5 28.7,56.64 32.77,52.58 47.5,52.58 49.53,54.61 v49.53,55.88 R7.1 | U$2.P$1 20.32,61.59 v21.21,62.48
N$6  (via drill 0.38)
  Top 0.305: U$1.21 27.41,63.52 v27.81,63.12 | C8.2 51.12,56.83 v52.07,55.88
  Bottom 0.305: v27.81,63.12 27.94,56.13 32.26,51.82 49.28,51.82 52.07,54.61 v52.07,55.88 R13.1
N$7  (via drill 0.38)
  Top 0.305: U$1.19 25.63,62.51 v26.16,61.98 | C9.1 56.83,56.2 v57.15,55.88
  Top 0.406: C9.1 C10.2
  Bottom 0.305: v26.16,61.98 26.16,55.37 31.24,50.29 52.83,50.29 57.15,54.61 v57.15,55.88 R9.1
N$8  (via drill 0.38)
  Top 0.305: U$1.18 24.84,62.03 v25.4,61.28 | C11.2 61.03,56.45 60.71,56.13 v59.69,56.13
  Top 0.406: C11.2 61.03,60.58 C10.1
  Bottom 0.305: v25.4,61.28 25.4,55.12 30.99,49.53 54.61,49.53 59.69,54.61 v59.69,56.13 R10.1
N$9  (via drill 0.38)
  Top 0.305: U$1.17 24.33,61.52 24.64,61.28 v24.64,60.26 | C11.1 62.93,56.58 v62.23,55.88
  Top 0.406: C11.1 62.93,60.57 C12.2
  Bottom 0.305: v24.64,60.26 24.64,54.86 30.73,48.77 57.66,48.77 62.23,53.34 v62.23,55.88 R11.1
N$10  (via drill 0.38)
  Top 0.305: 23.24,60.53 23.24,59.82 v23.62,59.44
  Top 0.406: v66.8,58.93 66.8,60.2 66.29,60.71 C12.1 | U$1.16 23.24,60.53 U$9.P$1
  Bottom 0.305: v23.62,59.44 23.62,54.61 30.23,48.01 59.44,48.01 64.77,53.34 R12.1
  Bottom 0.406: R12.1 66.14,58.27 v66.8,58.93
N$11  (via drill 0.38)
  Top 0.406: v41.15,63.5 40.13,64.52 40.13,68.33 U$33.4
  Bottom 0.406: R5.2 44.45,62.23 43.18,63.5 v41.15,63.5
N$12  (via drill 0.38)
  Top 0.305: U$1.27 32.03,66.52 v32.51,66.55
  Top 0.406: C2.2 36.26,57.22 v36.83,56.64
  Bottom 0.305: v32.51,66.55 32.51,58.17 34.29,56.39 36.58,56.39 v36.83,56.64
  Bottom 0.406: v36.83,56.64 R2.1
N$13
  Top 0.254: U$20.27 99.68,60.08 100.33,59.44 100.33,57.4 99.57,56.64 LED8.A
N$14
  Top 0.406: C26.2 C27.1
N$15  (via drill 0.38)
  Top 0.406: v38.1,63.5 38.1,68.33 U$33.3
  Bottom 0.406: R4.2 41.91,61.98 41.4,62.48 40.39,62.48 39.37,63.5 v38.1,63.5
N$16  (via drill 0.38)
  Top 0.406: v45.72,63.5 42.93,63.5 42.16,64.26 42.16,68.3 U$33.5
  Bottom 0.406: R6.2 46.99,62.23 v45.72,63.5
N$17
  Top 0.254: LED8.C R37.2
N$18  (via drill 0.38)
  Top 0.406: v55.88,63.5 56.64,63.5 57.4,64.26 57.4,68.27 U$24.1
  Bottom 0.406: R8.2 54.61,62.23 v55.88,63.5
N$19  (via drill 0.38)
  Top 0.406: v59.44,63.5 59.44,68.3 U$24.2
  Bottom 0.406: R9.2 57.15,61.21 v59.44,63.5
N$20  (via drill 0.38)
  Top 0.406: v61.47,63.5 61.47,68.33 U$24.3
  Bottom 0.406: R10.2 59.69,61.72 v61.47,63.5
N$21  (via drill 0.38)
  Top 0.406: v63.5,63.5 63.5,68.33 U$24.4
  Bottom 0.406: R11.2 62.23,62.23 v63.5,63.5
N$22
  Top 0.406: R31.1 55.88,39.11 55.88,42.67 54.86,43.69 U$8.3
N$23  (via drill 0.38)
  Top 0.305: U$1.20 26.64,63.02 v27.11,62.48 | C13.1 55.05,56.32 v54.61,55.88
  Top 0.406: C13.1 55.05,60.58 C9.2
  Bottom 0.305: v27.11,62.48 27.18,55.63 31.75,51.05 50.8,51.05 54.61,54.86 v54.61,55.88 R8.1
N$24
  Top 0.305: R16.2 10.48,61.91 8.89,63.5 7.62,63.5 6.35,64.77 6.35,69.09 7.49,70.23 12.69,70.23 U$26.1
N$25
  Top 0.305: C20.2 10.73,65.02 U$1.7
N$26  (via drill 0.38)
  Top 0.254: C14.1 12.13,45.21 23.62,45.21 v24.13,45.72 | v30.48,67.31 29.72,68.07 26.8,68.07 26.23,67.5 23.25,67.5 U$1.29
  Top 0.406: C16.2 C14.1 9.84,44.7 R15.1
  Bottom 0.254: v30.48,67.31 30.42,65.72 30.16,65.47 24.64,61.85 24.64,61.47 22.86,59.69 22.86,54.48 24.51,52.83 24.51,46.1 v24.13,45.72
N$27
  Top 0.406: JP3.1 2.67,53.34 1.27,54.61 1.27,59.69 2.34,60.76 S3.4
  Bottom 0.406: S3.4 3.58,60.83 R54.2 3.58,64.85 S3.3
N$28  (via drill 0.38)
  Top 0.254: U$1.28 28.91,67.01 v29.21,67.31 | v18.86,47.37 18.86,46.61 18.22,45.97 v13.34,45.97 | v8.76,48.89 8.76,48.32 C14.2
  Top 0.406: C15.1 C14.2 7.94,30.16 7.87,30.09 7.87,29.21 9.4,27.69 13.97,27.69 14.99,26.67 R14.1
  Bottom 0.254: v29.21,67.31 29.46,67.31 29.84,66.93 29.84,65.85 24.13,62.23 24.13,61.59 22.35,59.82 22.35,54.36 24,52.58 23.88,48.07 22.99,47.37 v18.86,47.37 | v13.34,45.97 12.19,45.97 11.43,46.74 11.43,48.39 10.79,49.02 8.89,49.02 v8.76,48.89
N$29  (via drill 0.38)
  Top 0.254: R15.2 13.02,41.98 13.72,42.67 13.72,44.09 R17.1
  Top 0.406: v17.78,17.78 18.54,17.02 R55.2 | v10.67,37.85 R15.2
  Bottom 0.406: C17.2 29.97,33.53 27.94,31.5 27.94,28.45 | v17.78,17.78 17.02,17.78 16.76,18.03 16.76,33.27 12.19,37.85 v10.67,37.85
  other vias: 18.29,28.19 19.3,28.19 18.29,27.18 19.3,27.18 19.3,26.16 18.29,26.16 18.29,25.15 19.3,25.15 19.3,24.13 18.29,24.13 18.29,23.11 19.3,23.11 19.3,22.1 18.29,22.1 18.29,21.08 19.3,21.08 19.3,20.07 18.29,20.07
  pour Bottom: 17.27,29.97 29.21,29.97 29.21,11.94 17.27,11.94
  pour Top: 17.27,11.94 17.27,29.97 29.21,29.97 29.21,11.94
N$30
  Bottom 0.203: R56.1 86.12,51.17 85.98,51.31 U$34.4
N$31  (via drill 0.38)
  Top 0.406: R31.2 48.76,26.93 48.77,26.92
  other vias: 46.23,25.4 47.24,25.4 46.23,24.38 47.24,24.38 47.24,23.37 46.23,23.37 46.23,22.35 47.24,22.35 47.24,21.34 46.23,21.34 46.23,20.32 47.24,20.32 47.24,19.3 46.23,19.3 46.23,18.29 47.24,18.29 47.24,17.27 46.23,17.27 48.26,25.4 49.28,25.4 48.26,24.38 49.28,24.38 49.28,23.37 48.26,23.37 48.26,22.35 49.28,22.35 49.28,21.34 48.26,21.34 48.26,20.32 49.28,20.32 49.28,19.3 48.26,19.3 48.26,18.29 49.28,18.29 49.28,17.27 48.26,17.27 50.29,25.4 51.31,25.4 50.29,24.38 51.31,24.38 51.31,23.37 50.29,23.37 50.29,22.35 51.31,22.35 51.31,21.34 50.29,21.34 50.29,20.32 51.31,20.32 51.31,19.3 50.29,19.3 50.29,18.29 51.31,18.29 51.31,17.27 50.29,17.27 52.32,25.4 53.34,25.4 52.32,24.38 53.34,24.38 53.34,23.37 52.32,23.37 52.32,22.35 53.34,22.35 53.34,21.34 52.32,21.34 52.32,20.32 53.34,20.32 53.34,19.3 52.32,19.3 52.32,18.29 53.34,18.29 53.34,17.27 52.32,17.27 44.2,25.4 45.21,25.4 44.2,24.38 45.21,24.38 45.21,23.37 44.2,23.37 44.2,22.35 45.21,22.35 45.21,21.34 44.2,21.34 44.2,20.32 45.21,20.32 45.21,19.3 44.2,19.3 44.2,18.29 45.21,18.29 45.21,17.27 44.2,17.27
  pour Bottom: 29.72,11.94 68.07,11.94 68.07,29.97 29.72,29.97
  pour Top: 29.72,11.94 29.72,29.97 68.07,29.97 68.07,11.94
N$32  (via drill 0.38)
  Top 0.305: U$5.1 v69.09,18.54
  Top 0.406: v66.55,44.2 66.57,44.17 R18.2 66.8,42.42 69.09,40.13 U$6.P$2
  Bottom 0.305: v69.09,18.54 69.09,35.81 66.55,38.35 66.55,40.06 R19.1
  Bottom 0.406: R19.1 66.55,40.21 v66.55,44.2
N$33  (via drill 0.38)
  Top 0.406: U$7.3 62.99,40.13 v61.72,40.13 U$6.P$1
  Bottom 0.406: v61.72,40.13 R19.2
N$34  (via drill 0.38)
  Top 0.254: U$1.2 15.57,67.51 v15.24,67.44 | v14.35,56.77 14.35,50.42 16.26,48.51
  Top 0.305: v27.94,45.72 28.45,45.21 34.16,45.21 36.58,47.62 43.18,47.62 46.23,50.67 52.7,50.67 55.12,48.26 62.23,48.26 62.47,48.27 64.77,45.97 64.77,45.21 62.47,42.92 U$7.2 | v28.57,42.67 29.08,42.67 29.59,42.16 29.59,39.75 v28.19,38.35 | 16.26,48.51 17.53,48.51 v17.78,48.26
  Bottom 0.254: v15.24,67.44 15.24,66.93 15.62,66.55 15.62,60.71 15.11,60.2 15.11,57.53 v14.35,56.77
  Bottom 0.305: v27.94,45.72 27.94,43.31 v28.57,42.67 | v28.19,38.35 28.19,35.31 26.42,33.53 18.16,33.53 16.26,35.43 16.26,35.56 15.62,36.2 15.62,48.01 15.88,48.26 v17.78,48.26
N$35
  Bottom 0.406: C17.1 C18.2
N$36
  Top 0.254: U$20.26 99.47,59.28 99.82,58.93 99.82,57.91 99.57,57.66 98.3,57.66 98.04,57.4 98.04,55.77 LED7.A
N$37  (via drill 0.38)
  Top 0.305: 17.42,62.99 18.67,62.99 18.8,62.87 18.8,61.85 18.47,61.52 U$1.14 16.56,61.52 16.13,61.09 v16.13,57.53 | 17.42,62.99 U$1.11 | 17.42,62.99 17.42,62.53 U$1.12
  Bottom 0.305: C19.2 15.43,56.84 v16.13,57.53
N$38
  Top 0.305: U$1.13 15.8,62.03 15.49,61.72 15.49,60.32 15.37,60.2 14.42,60.2 R20.1
N$39
  Bottom 0.305: U$21.3 86.29,64.84 85.85,65.28 85.85,65.79 | 85.85,65.79 85.85,66.29 86.23,66.68 87.09,66.68 U$21.1 | 85.85,65.79 83.82,65.79 82.04,67.56 82.04,71.37 82.8,72.14 CN1.2
  Bottom 0.406: C30.1 87.38,64.61 U$21.3
N$40  (via drill 0.38)
  Top 0.305: U$10.12 25.55,49.68 v25.65,49.78
  Top 0.406: U$12.1 43.55,41.91 v42.16,41.91
  Bottom 0.305: v25.65,49.78 25.65,44.2 27.94,41.91 v42.16,41.91
  Bottom 0.406: v42.16,41.91 42.32,41.76 R26.1
N$41  (via drill 0.38)
  Top 0.406: U$12.3 42.16,43.87 v42.16,45.47
  Bottom 0.406: v42.16,45.47 42.1,45.4 R27.2
N$42
  Top 0.406: U$20.23 95.18,55.7 95.76,55.12 96.01,55.12 96.52,54.61 96.52,44.45 97.03,43.94 JP4.1
N$43  (via drill 0.38)
  Top 0.406: U$11.1 39.42,43.48 U$13.P$1 39.42,44.76 v40.64,45.21
  Bottom 0.406: R1.2 R27.1 40.64,44.13 v40.64,45.21
N$44
  Top 0.406: U$11.3 38.47,41.08 R28.1
N$45  (via drill 0.38)
  Top 0.305: U$10.7 23.04,46.66 v22.86,46.48 | v37.47,39.24 40.33,39.24 R28.2
  Top 0.406: R28.2 40.45,39.12 R29.1 42.78,38.82 C22.1
  Bottom 0.305: v22.86,46.48 22.86,45.34 23.62,44.58 23.62,43.69 24.13,43.18 25.78,43.18 28.07,40.89 35.81,40.89 v37.47,39.24
N$46  (via drill 0.38)
  Top 0.406: U$8.1 52.07,46.09 v52.07,46.74
  Bottom 0.406: R33.2 48.51,45.97 49.78,47.24 52.07,47.24 | 52.07,47.24 53.34,47.24 54,46.58 R32.2 54,45.06 54.61,44.45 54.61,42.62 U$14.P$2 | v52.07,46.74 52.07,47.24
N$47
  Top 0.406: Q1.3 46.43,41.17 U$16.P$1
N$48  (via drill 0.38)
  Top 0.406: U$16.P$2 v48.01,40.89
  Bottom 0.406: v48.01,40.89 48.51,41.4 R33.1
N$49
  Top 0.406: Q1.1 48.51,45.08 R34.1
N$50  (via drill 0.38)
  Top 0.254: v21.59,56.52 21.59,54.28 U$10.27
  Bottom 0.305: C24.2 20.69,55.61 v21.59,56.52
N$51
  Top 0.254: U$10.24 23.04,53.16 23.37,52.83 24,52.83 24.64,52.2 64.9,52.2 66.04,53.34 66.04,55.88 68.58,58.42 68.58,59.69 71.12,62.23 71.12,69.98 72.01,70.87 76.83,70.87 77.98,69.72 77.98,67.64 S1.3
  Bottom 0.305: S1.4 77.5,73.66 76.2,73.66 75.5,72.96 R36.2 75.5,68.01 76.2,67.31 77.65,67.31 S1.3
N$52
  Top 0.305: LED1.A R38.2
N$53
  Top 0.305: LED2.A R39.2
N$54
  Top 0.305: LED3.A R40.2
N$55
  Top 0.305: LED4.A R41.2
N$56
  Top 0.305: LED5.A R42.2
N$57
  Top 0.305: U$10.16 27.5,54.23 LED1.C
N$58
  Top 0.305: U$10.17 26.54,55.75 26.92,56.13 LED2.C
N$59
  Top 0.305: U$10.18 26.04,56.77 26.67,57.4 LED3.C
N$60
  Top 0.305: U$10.19 25.55,57.81 26.42,58.67 LED4.C
N$61
  Top 0.305: U$10.20 25.04,58.32 26.8,59.94 LED5.C
N$62
  Top 0.406: LED6.A 28.22,49.93 R43.2
N$63  (via drill 0.38)
  Top 0.254: 36.83,46.99 43.43,46.99 46.61,50.16 | S2.3 77.98,57.43 77.98,52.96 75.82,50.8 69.85,50.8 68.58,49.53 68.58,46.99 67.31,45.72 v65.79,45.72
  Top 0.305: S2.3 S2.4 | U$10.14 26.54,45.85 27.94,44.45 34.29,44.45 36.83,46.99 | v63.5,45.72 56.77,45.72 52.32,50.16 46.61,50.16
  Bottom 0.305: R44.2 77.76,64.15 S2.4 | v65.79,45.72 v63.5,45.72
N$64
  Top 0.406: LED6.C 27.98,48.39 U$10.15
N$65  (via drill 0.38)
  Top 0.254: U$10.5 22.05,49.99 22.86,50.8 26.16,50.8 v26.8,50.16 | 48.26,49.21 R34.2 48.45,49.02 47.24,49.02 46.61,48.39 v46.61,46.99
  Bottom 0.254: v26.8,50.16 26.8,48.13 27.94,46.99 v46.61,46.99
N$66
  Top 0.305: U$10.11 25.04,44.35 24.51,43.81 19.56,43.81 18.03,42.29 18.03,39.5 18.41,39.12 R46.1
N$67
  Top 0.305: U$10.13 26.04,43.81 25.4,43.18 20.19,43.18 19.3,42.29 19.3,41.21 R45.1
N$68  (via drill 0.38)
  Top 0.254: U$15.2 10.92,36.58 11.68,37.34 16.76,37.34 17.27,36.83 20.07,36.83 v20.7,37.46
  Top 0.305: R45.2 21.27,42.1 21.59,42.42 25.65,42.42 v28.07,40.01
  Top 0.406: R45.2 R47.1
  Bottom 0.305: v28.07,40.01 25.65,42.42 22.35,42.42 22.1,42.16 R49.1 22.25,41.15 R47.1 23.88,40.32 23.88,38.1 23.24,37.46 v20.7,37.46
N$69  (via drill 0.38)
  Top 0.254: 19.81,37.46 19.81,37.91 R46.2 | U$17.2 9.4,38.61 v9.65,38.86 | v14.48,38.86 17.4,38.86 v17.78,38.48
  Top 0.305: v17.78,38.48 17.78,37.85 18.16,37.46 19.81,37.46
  Top 0.406: R46.2 R48.1
  Bottom 0.254: v9.65,38.86 v14.48,38.86
  Bottom 0.305: R50.1 18.06,38.76 v17.78,38.48
N$70  (via drill 0.38)
  Top 0.406: U$26.2 13.27,73.72 v13.59,74.04
  Bottom 0.406: R51.1 11.69,72.45 U$27.P$1 13.28,74.04 v13.59,74.04
N$71  (via drill 0.38)
  Top 0.254: U$20.12 92.04,63.28 v92.58,62.74 | v91.31,51.94 91.31,51.31 89.92,50.04 v89.41,50.04 | v89.41,40.01 v87.12,40.01
  Bottom 0.254: JP1.2 73.66,45.1 R60.1 73.03,44.44 73.03,41.66 74.04,40.64 75.56,40.64 76.83,39.37 81.66,39.37 82.3,40.01 v87.12,40.01 | v92.58,62.74 92.58,57.28 90.42,55.12 90.42,52.45 90.93,51.94 v91.31,51.94 | v89.41,50.04 v89.41,40.01
N$72
  Top 0.406: U$26.3 R35.2
N$73  (via drill 0.38)
  Top 0.254: U$1.1 15.13,68.47 v14.29,67.95 | v14.35,58.93 14.35,57.91 13.59,57.15 13.59,50.42 v16.64,47.37 | v18.41,44.45 16.92,44.45 R17.2 | 25.15,23.71 U$4.1
  Top 0.305: 25.15,23.71 25.15,26.67 19.05,32.77 v19.05,34.54
  Bottom 0.254: v14.29,67.95 14.1,66.8 15.11,65.79 15.11,61.09 14.35,60.32 v14.35,58.93 | v16.64,47.37 16.64,46.23 v18.41,44.45
  Bottom 0.305: v18.41,44.45 17.27,44.45 16.76,43.94 16.76,39.62 16.26,39.12 16.26,37.85 19.05,35.05 v19.05,34.54
N$74
  Bottom 0.406: C31.1 84.69,64.69 U$21.4
N$75
  Bottom 0.305: U$21.5 84.55,67.68 C32.1 85.09,68.44 85.09,69.34 85.6,69.85 87.88,69.85 88.39,69.34 88.39,68.33 89.92,66.8 95.76,66.8 96.77,65.79 96.77,48.26 95.53,47.02 U$23.1
N$76
  Top 0.254: LED7.C 98.22,52.16 R59.2
N$77  (via drill 0.38)
  Top 0.254: U$22.7 90.17,52.32 v91.19,53.34 | v95.25,65.72 97.92,65.72 U$20.34
  Bottom 0.254: v91.19,53.34 94.74,56.9 94.74,65.22 v95.25,65.72
N$78
  Bottom 0.203: C34.1 79.26,51.67 79.63,51.31 U$34.16
N$79  (via drill 0.38)
  Top 0.254: U$20.17 92.56,59.28 94.23,60.96 94.23,65.02 94.49,65.28 94.49,66.29 94.23,66.55 90.07,66.55 U$20.8 87.2,66.48 C29.1 C28.1 | R57.2 84.58,48.77 84.33,48.51 U$22.2 81.49,47.62 v80.9,47.62 | v72.39,49.53 76.33,49.53 76.96,48.89 76.96,46.74 77.85,45.85 80.52,45.85 v80.64,45.97
  Top 0.305: v87.88,58.17 87.88,59.28
  Top 0.406: R57.2 R58.2 87.64,59.28 87.88,59.28 U$20.17
  Bottom 0.254: JP1.1 71.12,48.26 v72.39,49.53 | v80.64,45.97 80.64,46.1 81.66,47.12 81.28,47.62 v80.9,47.62 | U$23.2 91.69,49.02 89.15,51.56 89.15,56.9 88.9,57.15
  Bottom 0.305: 88.9,57.15 v87.88,58.17
N$81
  Top 0.203: C41.2 82.8,42.93 83.44,42.29 84.07,42.29 84.2,42.16 84.2,41.14 U$25.2
N$84
  Bottom 0.203: 84.58,44.58 83.82,44.58 U$32.P$4
  Bottom 0.254: C40.1 85.08,44.08 84.58,44.58
P2_1
  Top 0.203: U$22.4 81.79,49.78 81.28,49.28 80.52,49.28 80.01,49.78
  Top 0.254: 80.01,49.78 79.5,50.29 79.5,64.01 80.26,64.77 89.89,64.77 U$20.10
P2_2  (via drill 0.38)
  Top 0.254: v91.19,54.61 91.69,54.61 92.2,54.1 92.2,50.8 90.55,49.15 88.77,49.15 88.14,49.78 U$22.3 | v93.6,65.66 90.03,65.66 U$20.9
  Bottom 0.254: v91.19,54.61 91.44,54.61 93.98,57.15 93.98,65.28 v93.6,65.66
PACK+  (via drill 0.38)
  other vias: 87.12,9.91 87.12,8.89 87.12,7.87 87.12,6.86 87.12,5.84 87.12,4.83 87.12,3.81 13.21,9.91 13.21,8.89 13.21,7.87 13.21,6.86 13.21,5.84 13.21,4.83 13.21,3.81 18.29,9.91 18.29,8.89 18.29,7.87 17.27,6.86 17.27,5.84 17.27,4.83 17.27,3.81 86.11,9.91 86.11,8.89 86.11,7.87 86.11,6.86 86.11,5.84 86.11,4.83 86.11,3.81 14.22,6.86 14.22,5.84 14.22,4.83 14.22,3.81 18.29,6.86 18.29,5.84 18.29,4.83 18.29,3.81 79.82,9.91 79.82,8.89 79.82,7.87 79.82,6.86 79.82,5.84 79.82,4.83 79.82,3.81 78.8,9.91 78.8,8.89 78.8,7.87 78.8,6.86 78.8,5.84 78.8,4.83 78.8,3.81 81.85,8.89 81.85,7.87 81.85,6.86 81.85,5.84 81.85,4.83 81.85,3.81 80.84,8.89 80.84,7.87 80.84,6.86 80.84,5.84 80.84,4.83 80.84,3.81 85.09,6.86 85.09,5.84 85.09,4.83 85.09,3.81 84.07,6.86 84.07,5.84 84.07,4.83 84.07,3.81 19.3,9.91 19.3,8.89 19.3,7.87 19.3,6.86 19.3,5.84 19.3,4.83 19.3,3.81 20.32,9.91 20.32,8.89 20.32,7.87 20.32,6.86 20.32,5.84 20.32,4.83 20.32,3.81 15.24,6.86 15.24,5.84 15.24,4.83 15.24,3.81 16.26,6.86 16.26,5.84 16.26,4.83 16.26,3.81 13.21,2.73 13.21,1.71 17.27,2.73 17.27,1.71 14.22,2.73 14.22,1.71 18.29,2.73 18.29,1.71 19.3,2.73 19.3,1.71 20.32,2.73 20.32,1.71 15.24,2.73 15.24,1.71 16.26,2.73 16.26,1.71 82.93,2.79 82.93,1.78 79.82,2.79 79.82,1.78 78.8,2.79 78.8,1.78 81.85,2.79 81.85,1.78 80.84,2.79 80.84,1.78 82.93,6.86 82.93,5.84 82.93,4.83 82.93,3.81 87.12,2.79 87.12,1.78 86.11,2.79 86.11,1.78 85.09,2.79 85.09,1.78 84.07,2.79 84.07,1.78
  pour Top: 0,0 101.6,0 101.6,11.43 0,11.43
  pour Bottom: 0,11.43 101.6,11.43 101.6,0 0,0
PACK-  (via drill 0.38)
  Top 0.254: v47.5,35.05 47.24,34.8 41.66,34.8 39.62,36.83 33.27,36.83 31.75,35.31 16,35.31 15.49,34.8 U$30.P$1 | v52.07,40.64 52.07,41.15 52.83,41.91 53.85,41.91 54.61,41.15 54.61,40.13 54.1,39.62 53.09,39.62 52.07,38.61 52.07,35.31 v51.69,34.92
  Top 0.406: U$8.2 52.07,41.28 v52.07,40.64 | v67.56,33.53 72.64,33.53 | 72.64,33.53 73.91,32.26 73.91,28.96 | R18.1 71.37,42.42 72.64,41.15 72.64,33.53
  Bottom 0.254: v47.5,35.05 51.56,35.05 v51.69,34.92 52.07,34.54 52.07,33.59 C18.1
  Bottom 0.406: R32.1 51.16,42.32 U$14.P$1 50.8,41.91 v52.07,40.64 | C18.1 v67.56,33.53
  other vias: 89.66,25.4 90.68,25.4 91.69,25.4 92.71,25.4 93.73,25.4 94.74,25.4 95.76,25.4 96.77,25.4 89.66,16.76 90.68,16.76 91.69,16.76 92.71,16.76 93.73,16.76 94.74,16.76 95.76,16.76 96.77,16.76 89.66,15.75 90.68,15.75 91.69,15.75 92.71,15.75 93.73,15.75 94.74,15.75 95.76,15.75 96.77,15.75 89.66,14.73 90.68,14.73 91.69,14.73 92.71,14.73 93.73,14.73 94.74,14.73 95.76,14.73 96.77,14.73 89.66,26.42 90.68,26.42 91.69,26.42 92.71,26.42 93.73,26.42 94.74,26.42 95.76,26.42 96.77,26.42 89.66,27.43 90.68,27.43 91.69,27.43 92.71,27.43 93.73,27.43 94.74,27.43 95.76,27.43 96.77,27.43
  pour Top: 68.58,11.94 68.58,29.97 101.6,29.97 101.6,11.94
  pour Bottom: 68.58,29.97 101.6,29.97 101.6,11.94 68.58,11.94
REGOUT  (via drill 0.38)
  Top 0.254: v22.04,52.83 22.04,54.18 U$10.26 | C44.2 18.86,56.07 19.3,55.88
  Top 0.305: R42.1 R41.1 R40.1 R39.1 R38.1 32.07,61.79 v33.27,62.99 | U$1.8 20.07,64.52 21.59,66.04 v21.59,67.31 | 30.61,48.89 30.35,48.64 29.4,48.64 R43.1 | v32.07,67.76 32.07,68.01 31.5,68.58 27.69,68.58 27.18,69.09 27.18,73.15 26.42,73.91 22.35,73.91 v22.1,73.66
  Top 0.406: 19.3,55.88 19.3,53.2 20.18,52.32 21.59,52.32 v22.04,52.83 22.1,52.2 22.86,51.44 29.59,51.44 30.61,50.42 30.61,48.89 30.61,46.61 30.99,46.23 v33.53,46.23 | v45.72,44.96 46.73,44.96 Q1.2 46.8,44.13 47.24,43.69 51.31,43.69 51.31,43.94 52.32,44.96 55.37,44.96 56.9,43.43 58.93,43.43 v59.44,43.94 | C44.2 18.73,56.58 v19.81,57.66 | v20.57,59.94 20.57,61.72 20.32,61.98 20.32,64.26 20.07,64.52
  Bottom 0.305: C23.2 21.59,52.32 v22.04,52.83 | 76.45,60.96 76.33,60.96 75.44,61.85 R44.1 | v21.59,67.31 21.59,69.15 21.24,69.5 | 21.24,69.5 R22.1 | 80.01,62.23 85.34,62.23 86.36,61.21 88.9,61.21 89.66,60.45 89.66,52.07 90.68,51.05 94.72,51.05 U$23.3 | v33.27,62.99 33.27,63.31 33.08,63.5 33.08,65.34 33.59,65.85 33.59,67.37 33.08,67.88 32.19,67.88 v32.07,67.76 | v22.1,73.66 22.1,70.36 21.24,69.5
  Bottom 0.406: R36.1 78.99,70.87 80.01,69.85 80.01,62.23 78.74,60.96 76.45,60.96 76.2,61.21 73.15,61.21 71.37,59.44 71.37,56.13 v59.44,43.94 | R23.1 20.57,68.83 R22.1 | v45.72,44.96 45.36,44.6 R26.2 44.2,45.97 43.94,46.23 v33.53,46.23 | v19.81,57.66 v20.57,59.94
REGSRC  (via drill 0.38)
  Top 0.305: v13.72,64.01 U$1.9
  Bottom 0.305: v13.72,64.01 C25.2 12.38,68.26 12.32,70.23 12.32,69.93 U$27.P$2
  Bottom 0.406: R51.2 12.2,70.55 U$27.P$2
SCL  (via drill 0.38)
  Top 0.203: R52.2 80.77,59.95 80.52,59.69 80.52,50.29 v80.77,50.04 | v80.77,40.13 85.09,40.13 85.34,39.88 85.34,39.23 U$25.8 85.46,39.12 89.41,39.12 92.46,36.07 JP5.2 | v79.76,49.02 79.76,47.62 v79.38,47.24 | v83.12,43.5 83.12,46.29 v84.07,47.24
  Top 0.254: R52.2 81.79,60.26 82.36,60.83 84.57,60.83 R57.1 | v79.38,47.24 79.88,46.74 82.68,46.74 83.12,46.29
  Top 0.406: U$20.14 85.42,61.68 R57.1
  Bottom 0.203: v80.77,40.13 80.52,40.39 77.47,40.39 76.96,40.89 76.96,45.21 78.74,46.99 79.12,46.99 v79.38,47.24 | U$32.P$2 83.39,45.36 82.87,44.83 82.87,43.75 v83.12,43.5 | v80.77,50.04 v79.76,49.02
  Bottom 0.254: U$34.11 83.07,48.25 v84.07,47.24
SCL_  (via drill 0.38)
  Top 0.254: U$10.4 21.54,49.84 20.7,50.67 18.03,50.67 17.65,51.05 16.89,51.05 16.51,51.44 16.51,56.77 17.14,57.4 18.16,57.4 v18.54,57.78 | v20.32,66.04 19.05,66.04 | v18.73,72.33 19.62,72.33 20.32,71.63 20.32,67.31
  Top 0.305: U$1.5 19.02,66.02 19.05,66.04 20.32,67.31
  Bottom 0.254: v18.54,57.78 18.54,64.9 19.68,66.04 v20.32,66.04
  Bottom 0.305: v18.73,72.33 20.32,72.32 R22.2
SDA  (via drill 0.38)
  Top 0.203: R53.2 83.06,59.95 83.57,59.44 v83.57,57.66 | v87.63,37.34 84.84,37.34 84.07,38.1 84.07,39.02 U$25.7
  Top 0.254: R53.2 83.19,59.95 83.44,60.2 85.6,60.2 86.23,60.83 87.36,60.83 R58.1
  Top 0.406: R58.1 89.97,60.85 U$20.15
  Bottom 0.203: U$34.12 82.57,46.52 82.54,46.49 | 82.54,46.49 U$32.P$10 | v83.57,57.66 87.38,57.66 88.39,56.64 88.39,46.74 | 88.39,46.74 88.14,46.48 82.55,46.48 82.54,46.49 | 88.39,46.74 88.39,38.86 | 88.39,38.86 88.39,38.1 v87.63,37.34 | JP5.3 88.65,38.61 88.39,38.86
SDA_  (via drill 0.38)
  Top 0.254: U$1.4 13.74,66.52 13.46,66.8 13.46,69.85 13.59,69.98 13.84,69.98 14.35,70.48 14.35,70.87 14.73,71.25 v16.13,71.25 | v17.27,50.16 20.45,50.16 21.08,49.53 21.08,48.41 U$10.3
  Bottom 0.254: 16.13,69.15 v16.13,71.25 16.13,61.34 17.14,60.32 17.14,53.98 16.51,53.34 16.51,50.93 v17.27,50.16
  Bottom 0.305: 16.13,69.15 R23.2
SENSOR_POWER  (via drill 0.38)
  Top 0.203: U$25.4 78.5,41.13 77.72,41.91 v77.72,44.45 | U$25.1 85.44,41.56 84.33,42.67 84.33,43.35 C43.1
  Top 0.254: C43.1 84.75,44.36 85.09,44.7 v87.63,44.7
  Top 0.305: v76.2,44.45 v77.72,44.45
  Bottom 0.152: 79.14,44.96 79.14,44.94 79.63,44.45 80.77,44.45 81.28,44.96 U$32.P$8
  Bottom 0.203: v77.72,44.45 77.72,44.58 78.23,45.09 78.47,45.09 C39.1 79.14,44.96 | C38.1 C33.1 85.27,45.76 U$32.P$1 83.77,45.78 82.93,45.78 82.17,44.96 U$32.P$8 | C36.1 C35.1 78.63,49.42 80.01,50.8 U$34.15 82.56,50.81 82.93,51.18 82.93,51.56 82.68,51.82 U$34.17 U$34.18 81.78,52.32 81.03,52.32 80.71,52.64 | C37.1 80.66,52.69 80.71,52.64 | 80.71,52.64 80.9,52.83 80.9,54.48 81.53,55.12 C42.2 82.3,55.26 82.3,56.13 82.55,56.39 86.11,56.39 86.61,55.88 R56.2
  Bottom 0.254: v87.63,44.7 87.63,45.47 87.38,45.72 86.73,45.72 C38.1 | 76.6,49.42 C36.1
  Bottom 0.305: 76.6,49.42 76.2,49.02 v76.2,44.45
SMBC  (via drill 0.38)
  Top 0.254: 27.43,38.86 24.38,35.81 14.48,35.81 13.97,35.31 U$19.P$2 | 27.43,38.86 27.43,39.5 25.78,41.15 R47.2 | 27.43,38.86 27.43,38.1 27.94,37.59 40.39,37.59 40.89,37.08 40.89,36.58 42.16,35.31
  Top 0.305: 42.16,35.31 46.48,35.31 47.24,36.07 47.24,39.37 47.75,39.88 52.32,39.88 v53.34,40.64 | v67.31,55.12 72.39,55.12 72.9,54.61 v76.96,54.61 | v81.53,56.64 81.53,59.18 R52.1
  Bottom 0.305: v53.34,40.64 55.12,40.64 55.88,41.4 55.88,43.18 67.06,54.36 67.06,54.86 v67.31,55.12 | v76.96,54.61 78.74,54.61 79.5,55.37 80.26,55.37 v81.53,56.64
SMBD  (via drill 0.38)
  Top 0.254: R48.2 22.29,36.32 12.95,36.32 12.45,35.81 U$18.P$2
  Top 0.305: R53.1 82.55,58.17 v82.3,57.91 | v26.42,39.12 R48.2
  Bottom 0.305: v82.3,57.91 81.03,57.91 78.49,55.37 71.88,55.37 61.47,44.96 61.47,44.45 59.94,42.93 58.17,42.93 57.4,42.16 57.4,39.62 55.12,37.34 35.31,37.34 33.53,39.12 v26.42,39.12
VC5X  (via drill 0.38)
  Top 0.305: R16.1 12.7,60.01 v12.7,61.47 12.7,61.72 13.14,62.16 R20.2 15.71,63.52 U$1.10 17.42,63.5 v19.37,63.5 | v48.26,68.58 50.42,68.58 C1.1
  Top 0.406: C13.2 53.02,58.3 C8.1 53.02,63.5 | C21.2 C1.1 51.18,68.58 52.07,68.58 53.02,67.63 53.02,63.5 | v54.61,64.01 53.53,64.01 53.02,63.5
  Bottom 0.305: v12.7,61.47 13.52,60.13 C19.1 | v19.37,63.5 U$2.P$2 26.47,64.57 27.94,66.04 27.94,67.31 29.21,68.58 v48.26,68.58
  Bottom 0.406: R24.1 54.1,63.5 v54.61,64.01
VC10X  (via drill 0.38)
  Top 0.305: U$1.15 17.4,60.53 U$9.P$2 19.3,59.18 20.45,58.04 22.73,58.04 23.24,58.55 24,58.55 27.05,61.34 30.99,63.88 v33.91,63.88 | C1.2 48.38,66.16 v48.26,66.04 | v69.85,66.04 69.85,65.13 R30.1
  Bottom 0.305: v69.85,66.04 v48.26,66.04 46.99,66.04 45.72,64.77 34.8,64.77 v33.91,63.88

### Text on the board
tPlace: BQ76930 | RESET | BOOT | LEDS | BOOT | BQ78350-R1 | REGOUT | Pressure Sensor | BATT | ESC | DATA | CLK | GND | SMBus/I2C | BATT- | PACK- | Longboard Battery Management v1.2 | BATT+ | Charles Hood | PACK+
bPlace: CHARGE- | CHARGE+